# EAGLE board axiom_beta_sensor_cmv12000_zif (EAGLE 7.7.0), part 1 of 2
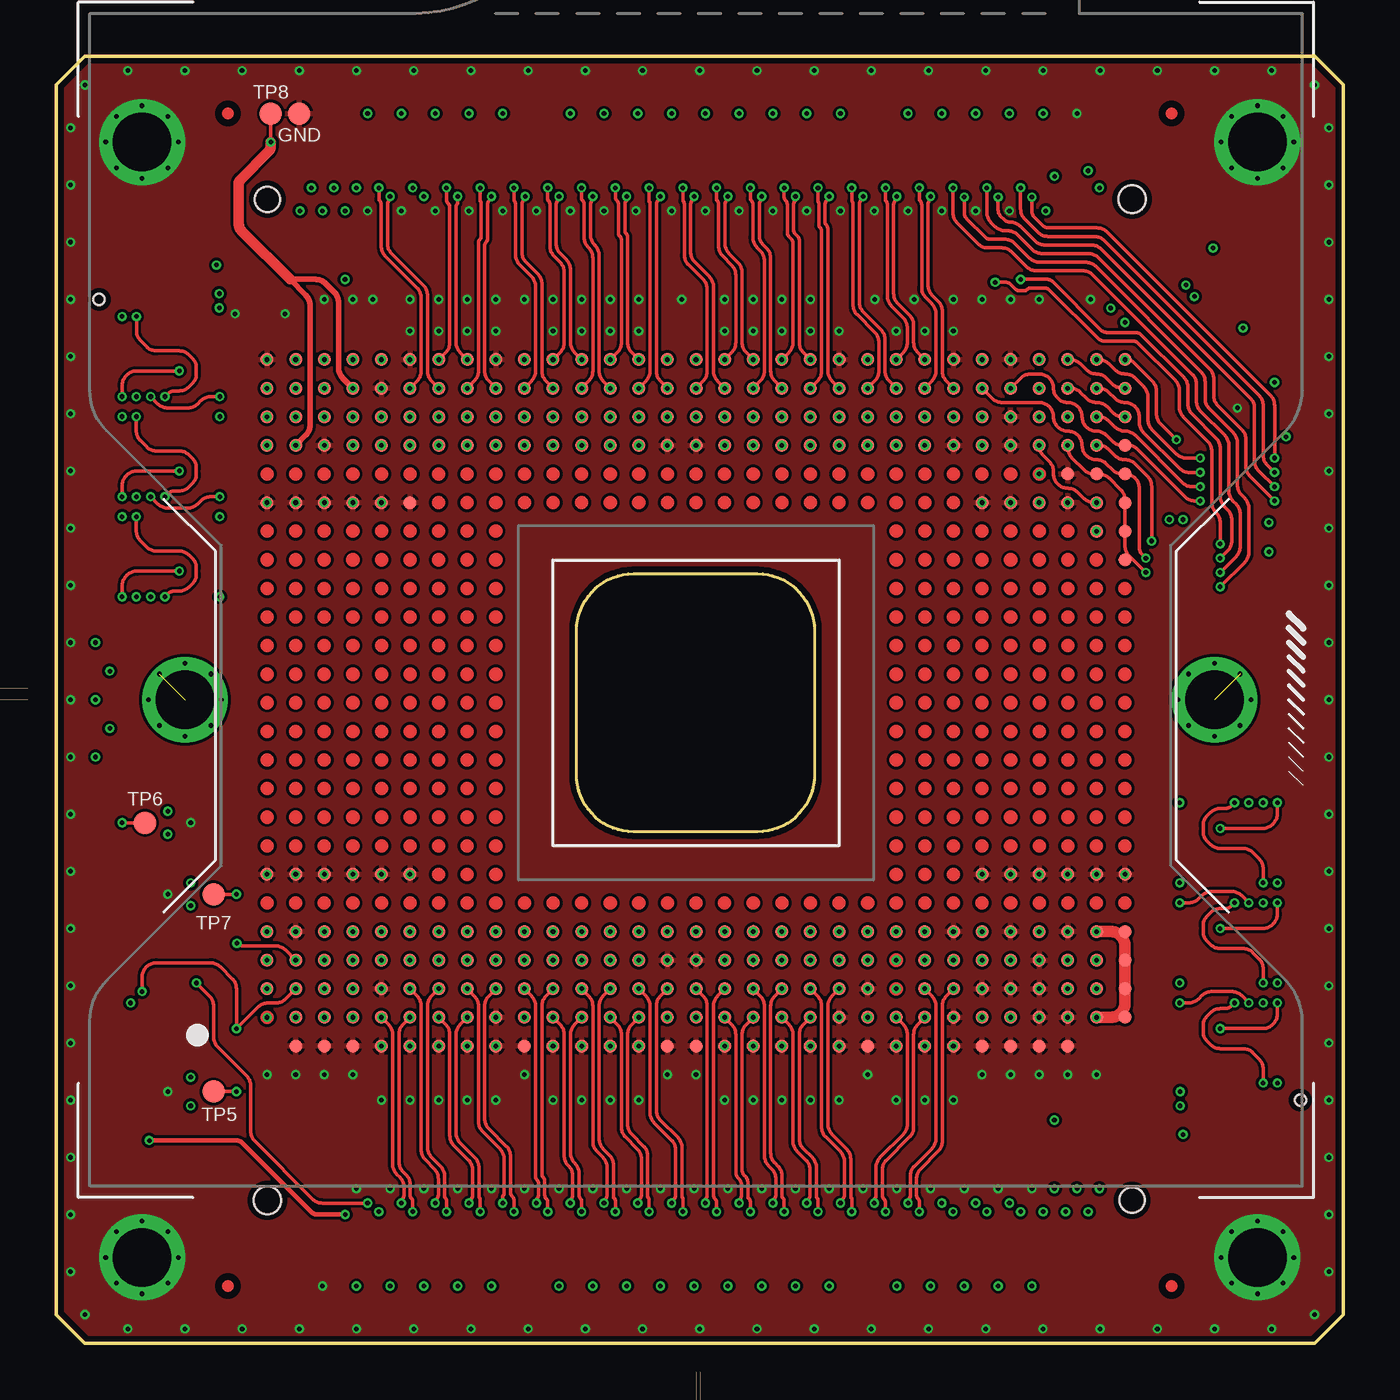
[diagram p5: board, top side]
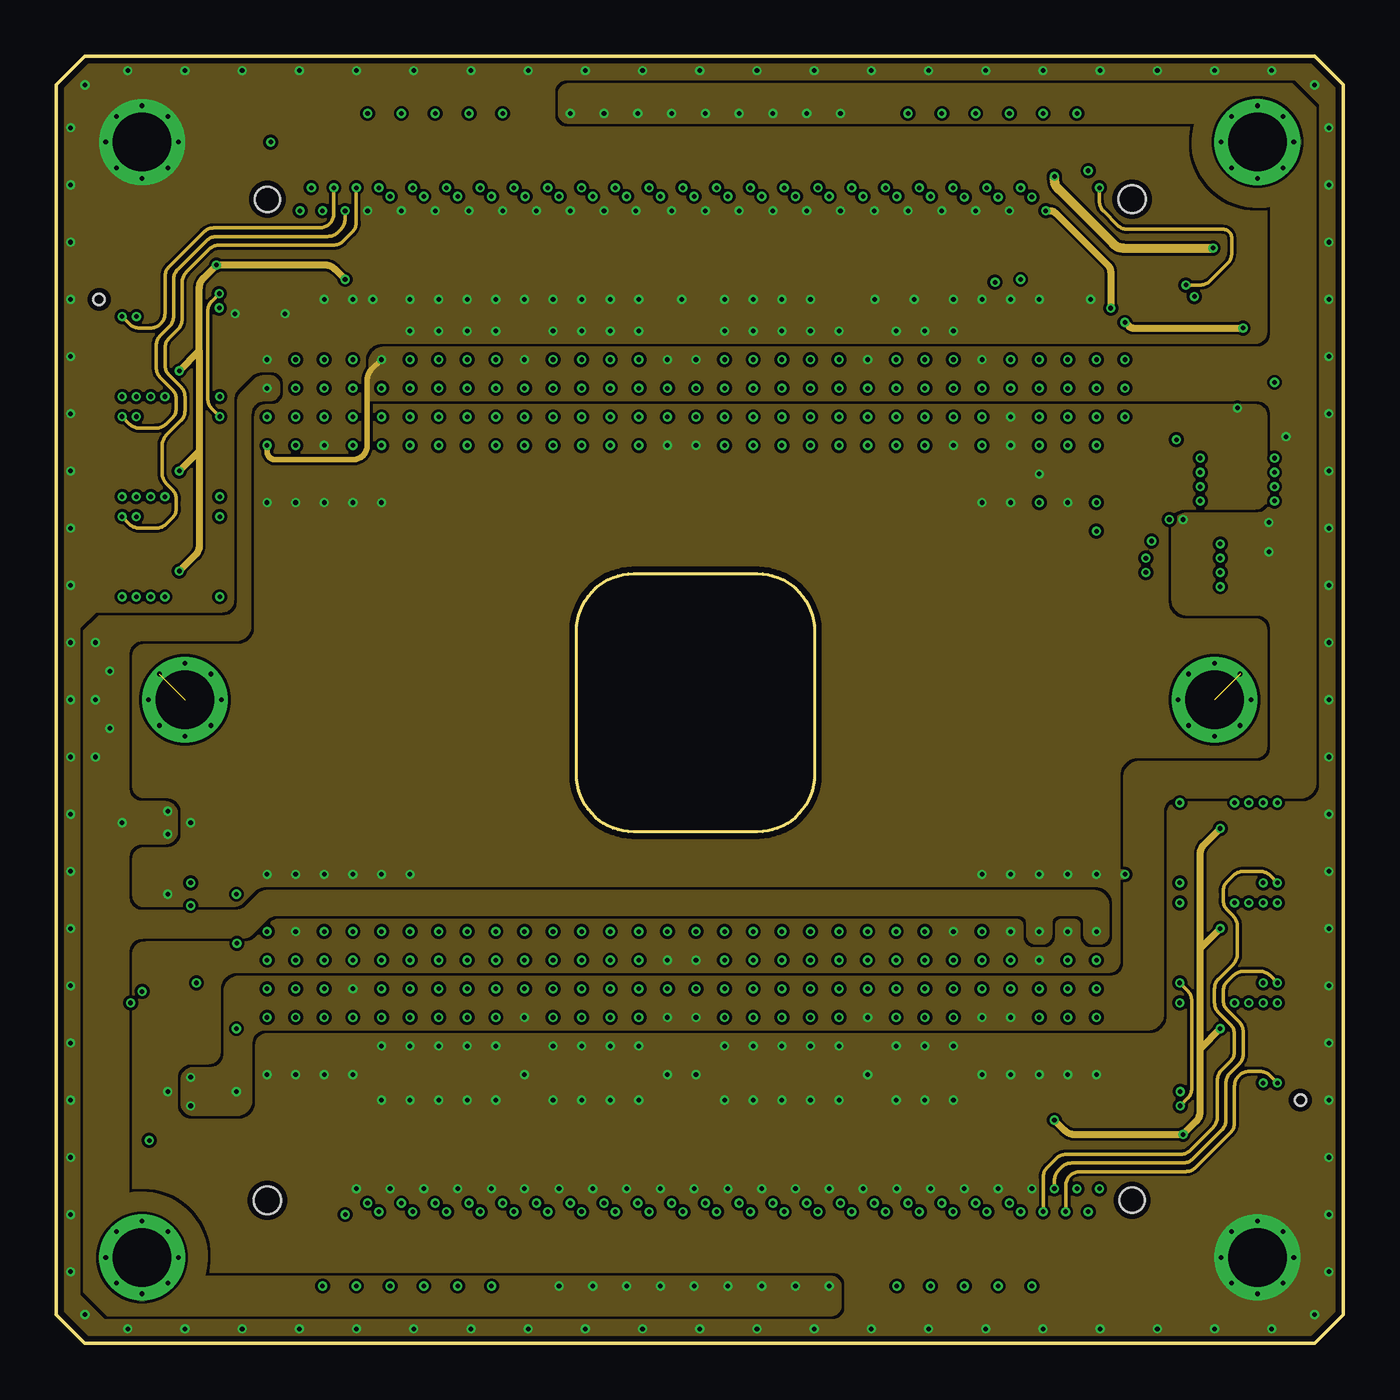
[diagram p6: board, inner layer Route2]
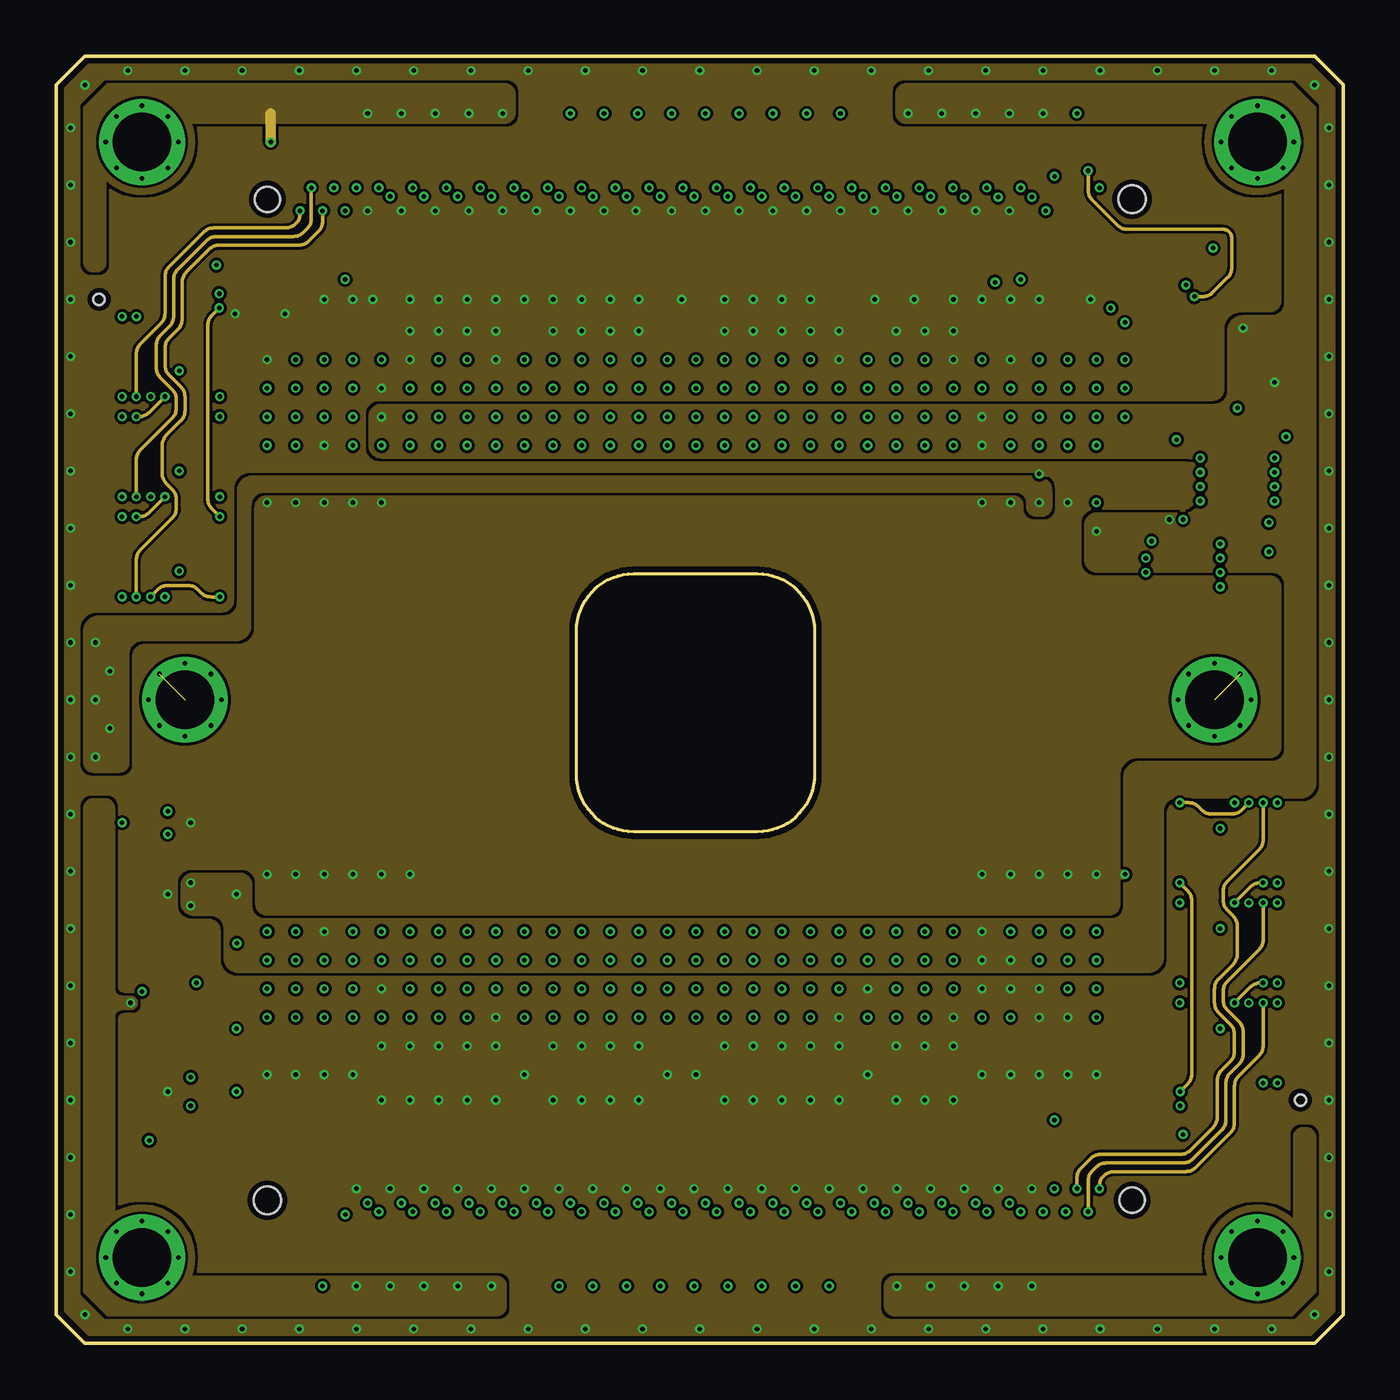
[diagram p7: board, inner layer Route15]
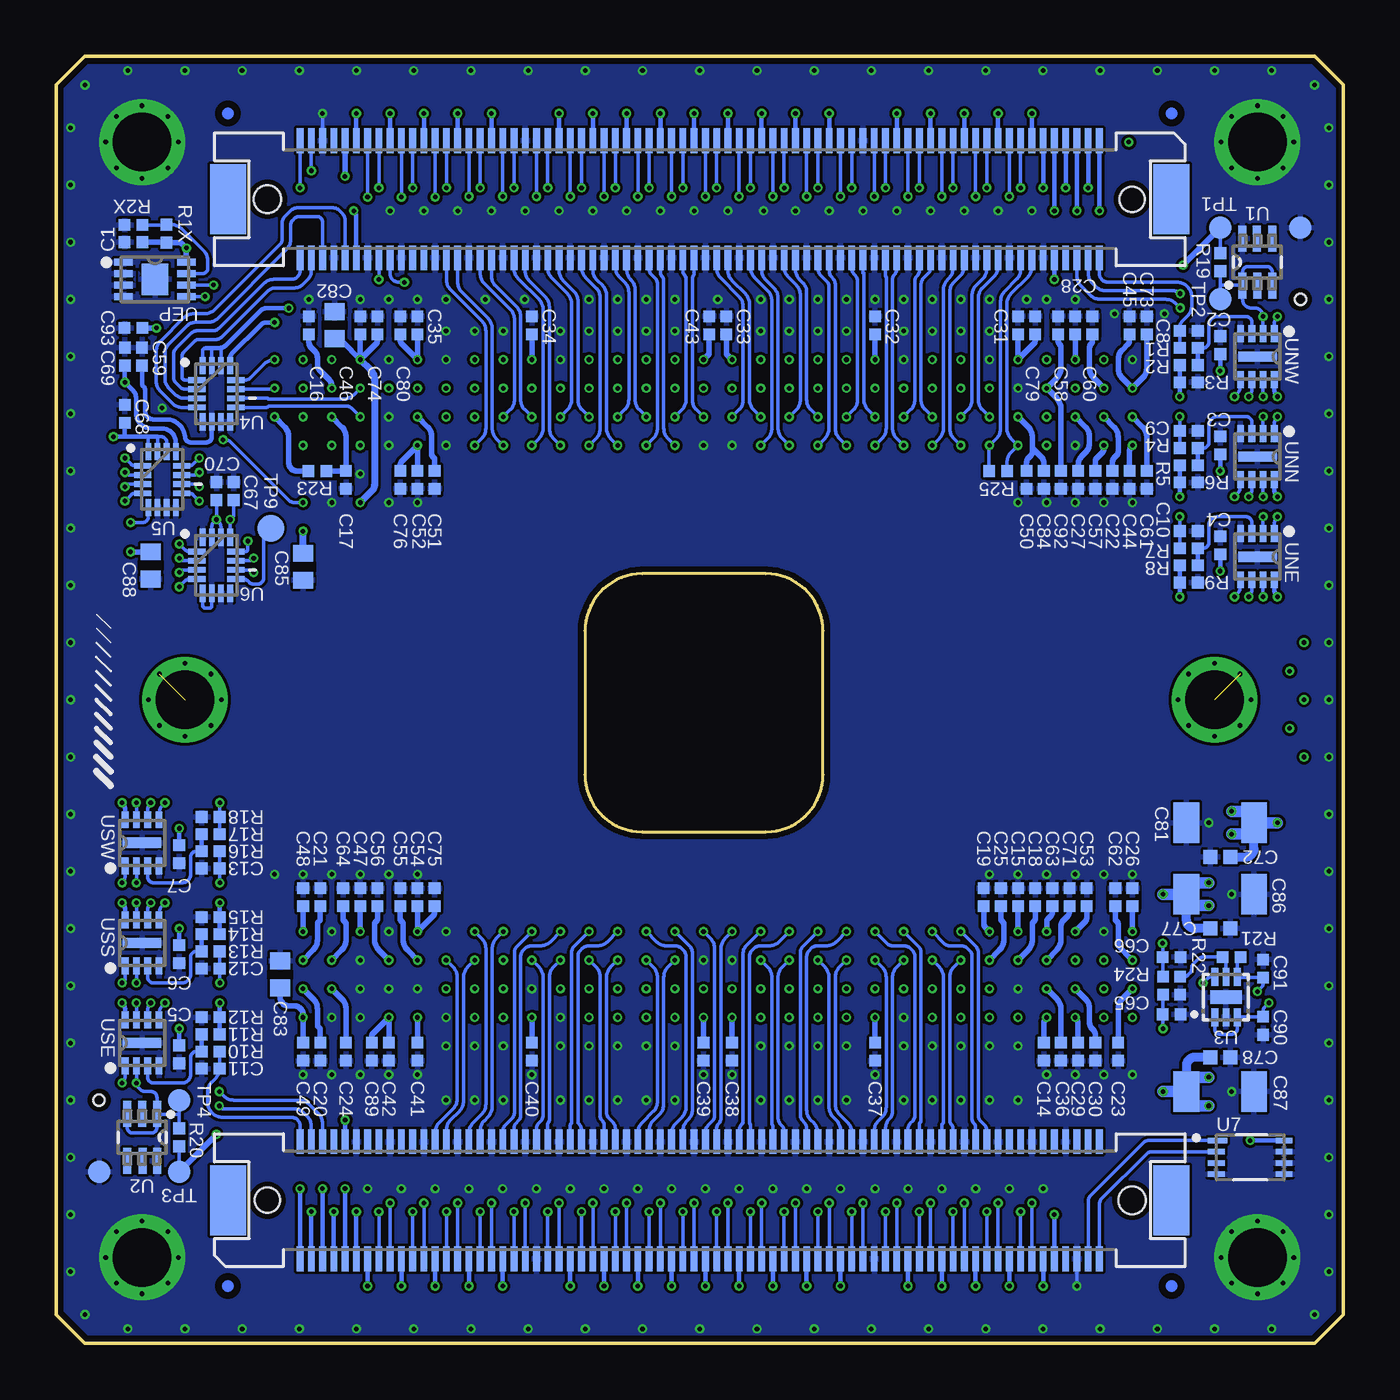
[diagram p8: board, bottom side, seen from below]

Size 57.15 x 57.15 mm. Coordinates in mm from the lower left corner, seen from the top.
Outline: 55.88,57.15 1.27,57.15 0,55.88 0,1.27 1.27,0 55.88,0 57.15,1.27 57.15,55.88 55.88,57.15
Outline: 31.13,22.71 25.64,22.71 arc-90 23.1,25.25 23.1,31.63 arc-90 25.64,34.17 31.13,34.17 arc-90 33.67,31.63 33.67,25.25 arc-90 31.13,22.71
Copper layers (1*2*15*16): Top 0.035559375mm / dielectric 0.17018125mm / Route2 0.01778125mm / dielectric 47mil / Route15 0.01778125mm / dielectric 0.17018125mm / Bottom 0.035559375mm
Design rules "axiom_beta_interface_OSHPark-4layer-tuned *": minimum track width 5mil, minimum drill 8mil, track to track 5mil, track to pad 5mil, pad to pad 5mil, via to via 5mil, smd to smd 5mil, copper to edge 10mil, drill to drill 6mil, minimum pad ring 4mil, minimum via ring 4mil, stop-mask expansion 2mil, vias tented up to drill 15mil, thermal gap 5mil
Net classes: 0 default: width 0.152 mm, drill 0.203 mm; 1 power: width 0.152 mm, drill 0.203 mm
Holes 0.5 mm at 55.25,10.79 1.9,46.36
tKeepout: area 50.8,1.3 to 55.9,6.3; area 50.8,50.8 to 55.9,55.9; area 1.3,1.3 to 6.3,6.3; area 1.3,50.8 to 6.3,55.9
bKeepout: area 1.4,24.8 to 13.4,32.4; area 43.9,24.8 to 56,32.4; area 50.8,1.3 to 55.9,6.3; area 1.3,50.8 to 6.3,55.9; area 50.8,50.8 to 55.9,55.9; area 1.3,1.3 to 6.3,6.3
tRestrict: area 49,54.1 to 50.1,55.2; area 7.1,2 to 8.2,3.1; area 7.1,54.1 to 8.2,55.2; area 49,2 to 50.1,3.1
bRestrict: area 49,54.1 to 50.1,55.2; area 7.1,2 to 8.2,3.1; area 7.1,54.1 to 8.2,55.2; area 49,2 to 50.1,3.1; area 48.9,41.7 to 49.5,41.8; area 48.9,42.1 to 49.5,42.2; area 52,36.9 to 52.1,37.3; area 52.4,36.9 to 52.5,37.3; area 51.6,36.9 to 51.7,37.3; area 49.6,33.1 to 49.7,33.5; area 49.2,33.1 to 49.3,33.5; area 53.9,47.7 to 54.5,47.8; 139 more areas

## Footprints (pad centres in the part's own frame; a part is rotated, then mirrored left to right if it is on the bottom)
0402-C = smd 0.52 x 0.52: 1 -0.4,0; 2 0.4,0
0402-B = smd 0.62 x 0.62: 1 -0.45,0; 2 0.45,0
1206-B = smd 1.15 x 1.8: 1 -1.5,0; 2 1.5,0
0603-C = smd 0.75 x 0.9: 1 -0.6,0; 2 0.6,0
TP10R = smd 1 x 1: TP 0,0
ZIF-604 = smd 0.584 x 0.584: A2 -17.945,-14.105; A3 -16.675,-14.105; A4 -15.405,-14.105; A5 -14.135,-14.105; A6 -12.865,-14.105; A7 -11.595,-14.105; A8 -10.325,-14.105; A9 -9.055,-14.105; A10 -7.785,-14.105; A11 -6.515,-14.105; A12 -5.245,-14.105; A13 -3.975,-14.105; A14 -2.705,-14.105; A15 -1.435,-14.105; A16 -0.165,-14.105; A17 1.105,-14.105; A18 2.375,-14.105; A19 3.645,-14.105; A20 4.915,-14.105; A21 6.185,-14.105; A22 7.455,-14.105; A23 8.725,-14.105; A24 9.995,-14.105; A25 11.265,-14.105; A26 12.535,-14.105; A27 13.805,-14.105; A28 15.075,-14.105; A29 16.345,-14.105; A30 17.615,-14.105; B1 -19.215,-12.835; B2 -17.945,-12.835; B3 -16.675,-12.835; B4 -15.405,-12.835; B5 -14.135,-12.835; B6 -12.865,-12.835; B7 -11.595,-12.835; B8 -10.325,-12.835; B9 -9.055,-12.835; B10 -7.785,-12.835; B11 -6.515,-12.835; B12 -5.245,-12.835; B13 -3.975,-12.835; B14 -2.705,-12.835; B15 -1.435,-12.835; B16 -0.165,-12.835; B17 1.105,-12.835; B18 2.375,-12.835; B19 3.645,-12.835; B20 4.915,-12.835; B21 6.185,-12.835; B22 7.455,-12.835; B24 9.995,-12.835; B25 11.265,-12.835; B26 12.535,-12.835; B27 13.805,-12.835; B28 15.075,-12.835; B29 16.345,-12.835; B30 17.615,-12.835; C1 -19.215,-11.565; C2 -17.945,-11.565; C3 -16.675,-11.565; C4 -15.405,-11.565; C5 -14.135,-11.565; C6 -12.865,-11.565; C7 -11.595,-11.565; C8 -10.325,-11.565; C9 -9.055,-11.565; C10 -7.785,-11.565; C11 -6.515,-11.565; C12 -5.245,-11.565; C13 -3.975,-11.565; C14 -2.705,-11.565; C15 -1.435,-11.565; C16 -0.165,-11.565; C17 1.105,-11.565; C18 2.375,-11.565; C19 3.645,-11.565; C20 4.915,-11.565; C21 6.185,-11.565; C22 7.455,-11.565; C24 9.995,-11.565; C25 11.265,-11.565; C26 12.535,-11.565; C27 13.805,-11.565; C28 15.075,-11.565; C29 16.345,-11.565; C30 17.615,-11.565; D1 -19.215,-10.295; D2 -17.945,-10.295; D3 -16.675,-10.295; D4 -15.405,-10.295; D5 -14.135,-10.295; D6 -12.865,-10.295; D7 -11.595,-10.295; D8 -10.325,-10.295; D9 -9.055,-10.295; D10 -7.785,-10.295; D11 -6.515,-10.295; D12 -5.245,-10.295; D13 -3.975,-10.295; D14 -2.705,-10.295; D15 -1.435,-10.295; D16 -0.165,-10.295; D17 1.105,-10.295; D18 2.375,-10.295; D19 3.645,-10.295; D20 4.915,-10.295; D21 6.185,-10.295; D22 7.455,-10.295; D23 8.725,-10.295; D24 9.995,-10.295; D25 11.265,-10.295; D26 12.535,-10.295; D27 13.805,-10.295; D28 15.075,-10.295; D29 16.345,-10.295; D30 17.615,-10.295; E1 -19.215,11.295; E2 -17.945,11.295; E3 -16.675,11.295; E4 -15.405,11.295; E5 -14.135,11.295; E6 -12.865,11.295; E7 -11.595,11.295; E8 -10.325,11.295; E9 -9.055,11.295; E10 -7.785,11.295; E11 -6.515,11.295; E12 -5.245,11.295; E13 -3.975,11.295; E14 -2.705,11.295; E15 -1.435,11.295; E16 -0.165,11.295; E17 1.105,11.295; E18 2.375,11.295; E19 3.645,11.295; E20 4.915,11.295; E21 6.185,11.295; E22 7.455,11.295; E23 8.725,11.295; E24 9.995,11.295; E25 11.265,11.295; E26 12.535,11.295; E27 13.805,11.295; E28 15.075,11.295; E29 16.345,11.295; E30 17.615,11.295; F1 -19.215,12.565; F2 -17.945,12.565; F3 -16.675,12.565; F4 -15.405,12.565; F5 -14.135,12.565; F6 -12.865,12.565; F7 -11.595,12.565; F8 -10.325,12.565; F9 -9.055,12.565; F10 -7.785,12.565; F11 -6.515,12.565; F12 -5.245,12.565; F13 -3.975,12.565; F14 -2.705,12.565; F15 -1.435,12.565; F16 -0.165,12.565; F17 1.105,12.565; F18 2.375,12.565; F19 3.645,12.565; F20 4.915,12.565; F21 6.185,12.565; F22 7.455,12.565; F23 8.725,12.565; F24 9.995,12.565; F25 11.265,12.565; F26 12.535,12.565; F27 13.805,12.565; F28 15.075,12.565; F29 16.345,12.565; F30 17.615,12.565; G1 -19.215,13.835; G2 -17.945,13.835; G3 -16.675,13.835; G4 -15.405,13.835; G5 -14.135,13.835; G6 -12.865,13.835; G7 -11.595,13.835; G8 -10.325,13.835; G9 -9.055,13.835; G10 -7.785,13.835; G11 -6.515,13.835; G12 -5.245,13.835; G13 -3.975,13.835; G14 -2.705,13.835; G15 -1.435,13.835; G16 -0.165,13.835; G17 1.105,13.835; G18 2.375,13.835; G19 3.645,13.835; G20 4.915,13.835; G21 6.185,13.835; G22 7.455,13.835; G23 8.725,13.835; G24 9.995,13.835; G25 11.265,13.835; G26 12.535,13.835; G27 13.805,13.835; G28 15.075,13.835; G29 16.345,13.835; G30 17.615,13.835; H1 -19.215,15.105; H2 -17.945,15.105; H3 -16.675,15.105; H4 -15.405,15.105; H5 -14.135,15.105; H6 -12.865,15.105; H7 -11.595,15.105; H8 -10.325,15.105; H9 -9.055,15.105; H10 -7.785,15.105; H11 -6.515,15.105; H12 -5.245,15.105; H13 -3.975,15.105; H14 -2.705,15.105; H15 -1.435,15.105; H16 -0.165,15.105; H17 1.105,15.105; H18 2.375,15.105; H19 3.645,15.105; H20 4.915,15.105; H21 6.185,15.105; H22 7.455,15.105; H23 8.725,15.105; H24 9.995,15.105; H25 11.265,15.105; H26 12.535,15.105; H27 13.805,15.105; H28 15.075,15.105; H29 16.345,15.105; H30 17.615,15.105; X2 -17.945,-15.375; X3 -16.675,-15.375; X4 -15.405,-15.375; X5 -14.135,-15.375; X6 -12.865,-15.375; X7 -11.595,-15.375; X8 -10.325,-15.375; X9 -9.055,-15.375; X10 -7.785,-15.375; X11 -6.515,-15.375; X12 -5.245,-15.375; X13 -3.975,-15.375; X14 -2.705,-15.375; X15 -1.435,-15.375; X16 -0.165,-15.375; X17 1.105,-15.375; X18 2.375,-15.375; X19 3.645,-15.375; X20 4.915,-15.375; X21 6.185,-15.375; X22 7.455,-15.375; X23 8.725,-15.375; X24 9.995,-15.375; X25 11.265,-15.375; X26 12.535,-15.375; X27 13.805,-15.375; X28 15.075,-15.375; X29 16.345,-15.375; Y1 -19.215,-7.755; Y2 -17.945,-7.755; Y3 -16.675,-7.755; Y4 -15.405,-7.755; Y5 -14.135,-7.755; Y6 -12.865,-7.755; Y7 12.535,-7.755; Y8 13.805,-7.755; Y9 15.075,-7.755; Y10 16.345,-7.755; Y11 17.615,-7.755; Y12 18.885,-7.755; Y13 -19.215,8.755; Y14 -17.945,8.755; Y15 -16.675,8.755; Y16 -15.405,8.755; Y17 -14.135,8.755; Y18 -12.865,8.755; Y19 12.535,8.755; Y20 13.805,8.755; Y21 15.075,8.755; Y22 16.345,8.755; Y23 17.615,8.755; Y24 18.885,8.755; Z1 18.885,-14.105; Z2 18.885,-12.835; Z3 18.885,-11.565; Z4 18.885,-10.295; Z5 18.885,6.215; Z6 18.885,7.485; Z7 18.885,10.025; Z8 18.885,11.295; Z9 18.885,12.565; Z10 18.885,13.835; Z11 18.885,15.105; Z12 17.615,7.485; Z13 17.615,10.025; Z14 16.345,10.025
TP12R = smd 1.2 x 1.2: TP 0,0
SOT65P210X110-6N = smd 1.168 x 0.356: 1 -1.041,0.66; 2 -1.041,0; 3 -1.041,-0.66; 4 1.041,-0.66; 5 1.041,0.025; 6 1.041,0.66
MLF-6 = smd 0.3 x 0.8: 1 -0.5,-0.9; 2 0,-0.9; 3 0.5,-0.9; 4 0.5,0.9; 5 0,0.9; 6 -0.5,0.9 | smd 1.4 x 0.6: EP 0,0
QFN40P185X265X55-16N = smd 0.762 x 0.254: 1 -0.864,0.61; 2 -0.864,0.203; 3 -0.864,-0.203; 4 -0.864,-0.61; 9 0.864,-0.61; 10 0.864,-0.203; 11 0.864,0.203; 12 0.864,0.61 | smd 0.254 x 0.762: 5 -0.61,-1.245; 6 -0.203,-1.245; 7 0.203,-1.245; 8 0.61,-1.245; 13 0.61,1.245; 14 0.203,1.245; 15 -0.203,1.245; 16 -0.61,1.245
SOT996-2/3 = smd 0.25 x 0.85: 1 -0.75,-1.45 | smd 0.25 x 0.75: 2 -0.25,-1.5; 3 0.25,-1.5; 4 0.75,-1.5; 5 0.75,1.5; 6 0.25,1.5; 7 -0.25,1.5; 8 -0.75,1.5
DFN200X300X100-9N = smd 0.813 x 0.305: 1 -1.397,0.762; 2 -1.397,0.254; 3 -1.397,-0.254; 4 -1.397,-0.762; 5 1.397,-0.762; 6 1.397,-0.254; 7 1.397,0.254; 8 1.397,0.762 | smd 1.194 x 1.397: EP 0,0
DFN200X200X100-9N = smd 0.75 x 0.3: 1 -1.025,0.75; 2 -1.025,0.25; 3 -1.025,-0.25; 4 -1.025,-0.75; 5 1.025,-0.75; 6 1.025,-0.25; 7 1.025,0.25; 8 1.025,0.75 | smd 0.45 x 1.7: EP 0,0
FX10A-144P = smd 0.3 x 1.1: 1 -17.75,-2.6; 2 -17.75,2.6; 3 -17.25,-2.6; 4 -17.25,2.6; 5 -16.75,-2.6; 6 -16.75,2.6; 7 -16.25,-2.6; 8 -16.25,2.6; 9 -15.75,-2.6; 10 -15.75,2.6; 11 -15.25,-2.6; 12 -15.25,2.6; 13 -14.75,-2.6; 14 -14.75,2.6; 15 -14.25,-2.6; 16 -14.25,2.6; 17 -13.75,-2.6; 18 -13.75,2.6; 19 -13.25,-2.6; 20 -13.25,2.6; 21 -12.75,-2.6; 22 -12.75,2.6; 23 -12.25,-2.6; 24 -12.25,2.6; 25 -11.75,-2.6; 26 -11.75,2.6; 27 -11.25,-2.6; 28 -11.25,2.6; 29 -10.75,-2.6; 30 -10.75,2.6; 31 -10.25,-2.6; 32 -10.25,2.6; 33 -9.75,-2.6; 34 -9.75,2.6; 35 -9.25,-2.6; 36 -9.25,2.6; 37 -8.75,-2.6; 38 -8.75,2.6; 39 -8.25,-2.6; 40 -8.25,2.6; 41 -7.75,-2.6; 42 -7.75,2.6; 43 -7.25,-2.6; 44 -7.25,2.6; 45 -6.75,-2.6; 46 -6.75,2.6; 47 -6.25,-2.6; 48 -6.25,2.6; 49 -5.75,-2.6; 50 -5.75,2.6; 51 -5.25,-2.6; 52 -5.25,2.6; 53 -4.75,-2.6; 54 -4.75,2.6; 55 -4.25,-2.6; 56 -4.25,2.6; 57 -3.75,-2.6; 58 -3.75,2.6; 59 -3.25,-2.6; 60 -3.25,2.6; 61 -2.75,-2.6; 62 -2.75,2.6; 63 -2.25,-2.6; 64 -2.25,2.6; 65 -1.75,-2.6; 66 -1.75,2.6; 67 -1.25,-2.6; 68 -1.25,2.6; 69 -0.75,-2.6; 70 -0.75,2.6; 71 -0.25,-2.6; 72 -0.25,2.6; 73 0.25,-2.6; 74 0.25,2.6; 75 0.75,-2.6; 76 0.75,2.6; 77 1.25,-2.6; 78 1.25,2.6; 79 1.75,-2.6; 80 1.75,2.6; 81 2.25,-2.6; 82 2.25,2.6; 83 2.75,-2.6; 84 2.75,2.6; 85 3.25,-2.6; 86 3.25,2.6; 87 3.75,-2.6; 88 3.75,2.6; 89 4.25,-2.6; 90 4.25,2.6; 91 4.75,-2.6; 92 4.75,2.6; 93 5.25,-2.6; 94 5.25,2.6; 95 5.75,-2.6; 96 5.75,2.6; 97 6.25,-2.6; 98 6.25,2.6; 99 6.75,-2.6; 100 6.75,2.6; 101 7.25,-2.6; 102 7.25,2.6; 103 7.75,-2.6; 104 7.75,2.6; 105 8.25,-2.6; 106 8.25,2.6; 107 8.75,-2.6; 108 8.75,2.6; 109 9.25,-2.6; 110 9.25,2.6; 111 9.75,-2.6; 112 9.75,2.6; 113 10.25,-2.6; 114 10.25,2.6; 115 10.75,-2.6; 116 10.75,2.6; 117 11.25,-2.6; 118 11.25,2.6; 119 11.75,-2.6; 120 11.75,2.6; 121 12.25,-2.6; 122 12.25,2.6; 123 12.75,-2.6; 124 12.75,2.6; 125 13.25,-2.6; 126 13.25,2.6; 127 13.75,-2.6; 128 13.75,2.6; 129 14.25,-2.6; 130 14.25,2.6; 131 14.75,-2.6; 132 14.75,2.6; 133 15.25,-2.6; 134 15.25,2.6; 135 15.75,-2.6; 136 15.75,2.6; 137 16.25,-2.6; 138 16.25,2.6; 139 16.75,-2.6; 140 16.75,2.6; 141 17.25,-2.6; 142 17.25,2.6; 143 17.75,-2.6; 144 17.75,2.6 | smd 1.6 x 3.1: M1 -20.95,0; M2 20.95,0 | hole 1.125: -19.2,0 | hole 1.225: 19.2,0

## Placement (x,y rotation side)
C1  100n  [0402-C]  53.72,48.89 180 bottom
C2  100n  [0402-C]  5.46,44.32 90 bottom
C3  100n  [0402-C]  5.46,39.88 90 bottom
C4  100n  [0402-C]  5.46,35.43 90 bottom
C5  100n  [0402-C]  51.69,12.83 270 bottom
C6  100n  [0402-C]  51.69,17.27 270 bottom
C7  100n  [0402-C]  51.69,21.72 270 bottom
C8  1µ  [0402-C]  6.86,44.96 0 bottom
C9  1µ  [0402-C]  6.86,40.51 0 bottom
C10  1µ  [0402-C]  6.86,36.07 0 bottom
C11  1µ  [0402-C]  50.29,12.19 180 bottom
C12  1µ  [0402-C]  50.29,16.64 180 bottom
C13  1µ  [0402-C]  50.29,21.08 180 bottom
C14  100n  [0402-C]  13.3,12.95 270 bottom
C15  100n  [0402-C]  14.44,19.8 90 bottom
C16  100n  [0402-C]  45.94,45.2 90 bottom
C17  100n  [0402-C]  44.28,38.35 270 bottom
C18  100n  [0402-C]  13.68,19.8 90 bottom
C19  100n  [0402-C]  15.96,19.8 90 bottom
C20  100n  [0402-C]  45.43,12.95 270 bottom
C21  100n  [0402-C]  45.43,19.8 90 bottom
C22  100n  [0402-C]  10.25,38.35 90 bottom
C23  100n  [0402-C]  10,12.95 90 bottom
C24  100n  [0402-C]  44.28,12.95 90 bottom
C25  100n  [0402-C]  15.2,19.8 270 bottom
C26  100n  [0402-C]  9.36,19.8 270 bottom
C27  100n  [0402-C]  11.77,38.35 90 bottom
C28  100n  [0402-C]  11.9,45.2 270 bottom
C29  100n  [0402-C]  11.77,12.95 270 bottom
C30  100n  [0402-C]  11.01,12.95 270 bottom
C31  100n  [0402-C]  14.44,45.2 90 bottom
C32  100n  [0402-C]  20.79,45.2 90 bottom
C33  100n  [0402-C]  27.39,45.2 90 bottom
C34  100n  [0402-C]  36.03,45.2 90 bottom
C35  100n  [0402-C]  41.11,45.2 90 bottom
C36  100n  [0402-C]  12.54,12.95 270 bottom
C37  100n  [0402-C]  20.79,12.95 270 bottom
C38  100n  [0402-C]  27.14,12.95 270 bottom
C39  100n  [0402-C]  28.41,12.95 270 bottom
C40  100n  [0402-C]  36.03,12.95 270 bottom
C41  100n  [0402-C]  41.11,12.95 270 bottom
C42  100n  [0402-C]  42.38,12.95 270 bottom
C43  100n  [0402-C]  28.16,45.2 90 bottom
C44  100n  [0402-C]  9.49,38.35 270 bottom
C45  100n  [0402-C]  9.49,45.2 90 bottom
C46  100n  [0402-C]  43.65,45.2 90 bottom
C47  100n  [0402-C]  43.65,19.8 90 bottom
C48  100n  [0402-C]  46.19,19.8 90 bottom
C49  100n  [0402-C]  46.19,12.95 270 bottom
C50  100n  [0402-C]  14.06,38.35 270 bottom
C51  100n  [0402-C]  40.35,38.35 270 bottom
C52  100n  [0402-C]  41.11,38.35 270 bottom
C53  100n  [0402-C]  11.39,19.8 90 bottom
C54  100n  [0402-C]  41.11,19.8 90 bottom
C55  100n  [0402-C]  41.87,19.8 90 bottom
C56  100n  [0402-C]  42.89,19.8 90 bottom
C57  100n  [0402-C]  11.01,38.35 270 bottom
C58  100n  [0402-C]  12.66,45.2 90 bottom
C59  100n  [0402-C]  53.34,43.81 90 bottom
C60  100n  [0402-C]  11.14,45.2 90 bottom
C61  100n  [0402-C]  8.72,38.35 270 bottom
C62  100n  [0402-C]  10.12,19.8 90 bottom
C63  100n  [0402-C]  12.92,19.8 90 bottom
C64  100n  [0402-C]  44.41,19.8 90 bottom
C65  100n  [0402-C]  7.62,14.6 0 bottom
C66  100n  [0402-C]  7.62,17.14 0 bottom
C67  100n  [0402-C]  49.28,37.85 90 bottom
C68  100n  [0402-C]  54.1,41.27 90 bottom
C69  100n  [0402-C]  54.1,43.81 90 bottom
C70  100n  [0402-C]  50.04,37.85 90 bottom
C71  100n  [0402-C]  12.15,19.8 90 bottom
C72  4µ7  [0402-B]  5.46,21.59 180 bottom
C73  4µ7  [0402-C]  8.72,45.2 90 bottom
C74  4µ7  [0402-C]  42.89,45.2 90 bottom
C75  4µ7  [0402-C]  40.35,19.8 90 bottom
C76  4µ7  [0402-C]  41.87,38.35 270 bottom
C77  4µ7  [0402-B]  5.46,18.41 0 bottom
C78  4µ7  [0402-B]  5.46,12.7 0 bottom
C79  4µ7  [0402-C]  13.68,45.2 90 bottom
C80  4µ7  [0402-C]  41.87,45.2 90 bottom
C81  100µ  [1206-B]  5.46,23.11 180 bottom
C82  10µ  [0603-C]  44.79,45.2 90 bottom
C83  10µ  [0603-C]  47.21,16.38 90 bottom
C84  4µ7  [0402-C]  13.3,38.35 270 bottom
C85  10µ  [0603-C]  46.19,34.48 270 bottom
C86  100µ  [1206-B]  5.46,19.94 0 bottom
C87  100µ  [1206-B]  5.46,11.18 0 bottom
C88  10µ  [0603-C]  52.96,34.54 270 bottom
C89  4µ7  [0402-C]  43.14,12.95 270 bottom
C90  4µ7  [0402-C]  3.56,14.1 270 bottom
C91  4µ7  [0402-C]  3.56,16.64 270 bottom
C92  4µ7  [0402-C]  12.54,38.35 270 bottom
C93  100n  [0402-C]  53.72,45.09 180 bottom
GND  TPTP10R  [TP10R]  10.79,54.61 0 top
GND75  TPTP10R  [TP10R]  1.9,49.53 180 bottom
GND77  TPTP10R  [TP10R]  55.25,7.62 180 bottom
PARALLELLA  [PARALLELLA-FRAME]  28.57,28.57 0 top
R1  28k7  [0402-C]  6.86,44.2 0 bottom
R1X  10k  [0402-C]  52.26,49.28 90 bottom
R2  3k32  [0402-C]  6.86,43.43 180 bottom
R2X  [0402-C]  53.72,49.66 180 bottom
R3  16k9  [0402-C]  6.86,42.67 0 bottom
R4  15k4  [0402-C]  6.86,39.75 0 bottom
R5  3k09  [0402-C]  6.86,38.99 180 bottom
R6  30k9  [0402-C]  6.86,38.23 0 bottom
R7  28k7  [0402-C]  6.86,35.31 0 bottom
R8  3k32  [0402-C]  6.86,34.54 180 bottom
R9  16k9  [0402-C]  6.86,33.78 0 bottom
R10  [0402-C]  50.29,12.95 180 bottom
R11  [0402-C]  50.29,13.72 0 bottom
R12  [0402-C]  50.29,14.48 180 bottom
R13  22k6  [0402-C]  50.29,17.4 180 bottom
R14  9k53  [0402-C]  50.29,18.16 0 bottom
R15  16k9  [0402-C]  50.29,18.92 180 bottom
R16  18k7  [0402-C]  50.29,21.84 180 bottom
R17  13k3  [0402-C]  50.29,22.61 0 bottom
R18  16k9  [0402-C]  50.29,23.37 180 bottom
R19  18k  [0402-C]  5.46,48.01 270 bottom
R20  18k  [0402-C]  51.69,9.14 90 bottom
R21  5k9  [0402-C]  4.95,17.14 0 bottom
R22  14k3  [0402-C]  7.24,15.88 90 bottom
R23  0R  [0402-C]  45.55,38.73 0 bottom
R24  0R  [0402-C]  8,15.88 90 bottom
R25  100R  [0402-C]  15.33,38.73 180 bottom
SENSOR  CMV12000-ZIF  [ZIF-604]  28.57,28.57 0 top
TP1  TPTP10R  [TP10R]  5.46,49.53 0 bottom
TP2  TPTP10R  [TP10R]  5.46,46.36 0 bottom
TP3  TPTP10R  [TP10R]  51.69,7.62 0 bottom
TP4  TPTP10R  [TP10R]  51.69,10.79 0 bottom
TP5  TPTP10R  [TP10R]  6.98,11.18 0 top
TP6  TPTP10R  [TP10R]  3.94,23.11 0 top
TP7  TPTP10R  [TP10R]  6.98,19.94 0 top
TP8  TPTP10R  [TP10R]  9.52,54.61 0 top
TP9  TPTP12R  [TP12R]  47.62,36.2 0 bottom
U1  TLV431DCK  [SOT65P210X110-6N]  3.81,48.01 90 bottom
U2  TLV431DCK  [SOT65P210X110-6N]  53.34,9.14 270 bottom
U3  MIC47050YML  [MLF-6]  5.21,15.37 0 bottom
U4  SN74AVC4T774RSV  [QFN40P185X265X55-16N]  50.04,42.16 0 bottom
U5  SN74AVC4T774RSV  [QFN40P185X265X55-16N]  52.45,38.35 0 bottom
U6  SN74AVC4T774RSV  [QFN40P185X265X55-16N]  50.04,34.54 0 bottom
U7  LM75BGD  [SOT996-2/3]  4.13,8.25 270 bottom
U$1  [µZ-FRAME]  28.57,28.57 0 top
UEP  BR24G04NUX  [DFN200X300X100-9N]  52.77,47.24 0 bottom
UNE  TS332IQ2T  [DFN200X200X100-9N]  3.81,34.92 270 bottom
UNN  TS332IQ2T  [DFN200X200X100-9N]  3.81,39.37 270 bottom
UNW  TS332IQ2T  [DFN200X200X100-9N]  3.81,43.81 270 bottom
USE  TS332IQ2T  [DFN200X200X100-9N]  53.34,13.33 90 bottom
USS  TS332IQ2T  [DFN200X200X100-9N]  53.34,17.78 90 bottom
USW  TS332IQ2T  [DFN200X200X100-9N]  53.34,22.23 90 bottom
X-NORTH  FX10-144P  [FX10A-144P]  28.57,50.8 180 bottom
X-SOUTH  FX10-144P  [FX10A-144P]  28.57,6.35 0 bottom

## Tracks (layer width: path | path; a pad name or v marks a point on that pad's centre or on a via)
CLK_IN  (via drill 0.2)
  Top 0.152: v48.64,35.62 48.64,38.05 arc45 48.45,38.5 47.91,39.05 arc45 47.46,39.23 arc-45 47.01,39.42 46.75,39.68 arc45 46.3,39.87 SENSOR.E30
  Bottom 0.152: U6.12 48.77,35.15 arc-90 48.64,35.28 v48.64,35.62
  other vias: 46.19,39.87
FRAME_REQ  (via drill 0.2)
  Top 0.152: 46.22,42.41 SENSOR.G30 46.3,42.41 arc-45 46.75,42.22 47.01,41.96 arc45 47.46,41.77 arc-90 48.09,41.14 48.09,40.89 arc45 48.28,40.45 49.87,38.86 arc45 50.32,38.67 v50.8,38.67
  Bottom 0.152: v50.8,38.67 50.84,38.63 arc45 51.02,38.56 U5.11
  other vias: 46.19,42.41
GND  (via drill 0.2, 2.6 pad 3.81)
  Bottom 0.152: X-NORTH.139 v45.33,54.61 | X-SOUTH.139 v11.82,2.54
  other vias: 1.27,55.88 1.27,1.27 0.63,3.18 0.63,5.71 0.63,8.25 0.63,10.79 0.63,13.33 0.63,15.88 0.63,18.41 0.63,20.95 0.63,23.49 0.63,26.04 0.63,28.57 0.63,31.11 0.63,33.66 0.63,36.2 0.63,38.73 0.63,41.27 0.63,43.81 0.63,46.36 0.63,48.89 0.63,51.44 0.63,53.97 56.52,3.18 56.52,5.71 56.52,8.25 56.52,10.79 56.52,13.33 56.52,15.88 56.52,18.41 56.52,20.95 56.52,23.49 56.52,26.04 56.52,28.57 56.52,31.11 56.52,33.66 56.52,36.2 56.52,38.73 56.52,41.27 56.52,43.81 56.52,46.36 56.52,48.89 56.52,51.44 56.52,53.97 55.88,55.88 53.97,56.52 51.44,56.52 48.89,56.52 46.36,56.52 43.81,56.52 41.27,56.52 38.73,56.52 36.2,56.52 33.66,56.52 31.11,56.52 28.57,56.52 26.04,56.52 23.49,56.52 20.95,56.52 18.41,56.52 15.88,56.52 13.33,56.52 10.79,56.52 8.25,56.52 5.71,56.52 3.18,56.52 53.97,0.63 51.44,0.63 48.89,0.63 46.36,0.63 43.81,0.63 41.27,0.63 38.73,0.63 36.2,0.63 33.66,0.63 31.11,0.63 28.57,0.63 26.04,0.63 23.49,0.63 20.95,0.63 18.41,0.63 15.88,0.63 13.33,0.63 10.79,0.63 8.25,0.63 5.71,0.63 3.18,0.63 55.88,1.27 15.71,46.36 16.98,46.36 18.25,46.36 19.52,46.36 14.06,46.36 20.79,46.36 22.06,46.36 23.33,46.36 24.6,46.36 25.87,46.36 27.77,46.36 29.68,46.36 30.95,46.36 32.22,46.36 33.49,46.36 33.49,44.95 34.76,44.95 32.22,44.95 30.95,44.95 29.68,44.95 25.87,44.95 24.6,44.95 23.33,44.95 22.06,44.95 19.52,44.95 18.25,44.95 16.98,44.95 15.71,44.95 38.57,44.95 39.84,44.95 37.3,44.95 14.44,13.2 15.71,13.2 16.98,13.2 18.25,13.2 19.52,13.2 20.79,11.93 22.06,13.2 23.33,13.2 24.6,13.2 25.87,13.2 27.14,11.93 28.41,11.93 29.68,13.2 30.95,13.2 32.22,13.2 33.49,13.2 34.76,13.2 36.03,11.93 37.3,13.2 38.57,13.2 39.84,13.2 37.3,10.79 38.57,10.79 39.84,10.79 34.76,10.79 33.49,10.79 32.22,10.79 30.95,10.79 29.68,10.79 25.87,10.79 24.6,10.79 23.33,10.79 22.06,10.79 19.52,10.79 18.25,10.79 16.98,10.79 15.71,10.79 14.44,10.79 42.38,46.36 43.65,46.36 11.9,46.36 13.17,46.36 13.17,37.33 14.44,37.33 10.63,37.33 9.36,37.33 42.38,37.33 41.11,20.82 42.38,20.82 43.65,20.82 44.92,20.82 46.19,20.82 9.36,20.82 10.63,20.82 11.9,20.82 13.17,20.82 14.44,20.82 15.71,20.82 41.11,11.93 42.38,11.93 43.65,11.93 44.92,11.93 46.19,11.93 9.36,11.93 10.63,11.93 11.9,11.93 13.17,11.93 16.32,6.86 17.82,6.86 19.32,6.86 20.79,6.86 22.32,6.86 23.82,6.86 25.32,6.86 26.82,6.86 28.32,6.86 29.82,6.86 31.32,6.86 32.83,6.86 34.33,6.86 35.83,6.86 37.33,6.86 38.83,6.86 14.82,6.86 13.82,50.29 15.32,50.29 16.82,50.29 18.32,50.29 19.82,50.29 21.32,50.29 22.82,50.29 24.32,50.29 25.74,50.29 27.32,50.29 28.82,50.29 30.32,50.29 31.82,50.29 33.33,50.29 34.83,50.29 36.33,50.29 37.83,50.29 39.33,50.29 11.9,37.33 41.11,37.33 44.92,37.33 41.11,46.36 10.16,45.72 7.94,45.72 39.84,46.36 34.76,14.47 36.03,15.74 41.11,15.74 42.38,15.74 43.65,15.74 43.65,14.47 43.65,17.01 44.92,18.28 42.38,18.28 39.84,18.28 39.84,14.47 47.46,20.82 14.44,15.74 19.52,14.47 27.14,17.01 28.41,17.01 34.76,43.68 39.84,43.68 42.38,43.68 42.38,41.14 42.38,39.87 39.84,39.87 27.14,39.87 28.41,39.87 15.71,43.68 19.52,43.68 9.36,43.68 11.9,39.87 36.35,46.36 38.1,46.36 14.44,42.41 10.63,18.28 44.92,14.47 40.33,6.86 41.83,6.86 43.33,6.86 13.32,6.86 40.83,50.29 42.33,50.29 43.65,38.6 5.97,23.11 4.95,19.94 4.95,11.18 45.94,46.36 3.81,3.81 53.34,53.34 3.81,5.43 5.43,3.81 3.81,2.19 2.19,3.81 4.95,4.95 4.95,2.67 2.67,2.67 2.67,4.95 53.34,3.81 53.34,5.43 54.96,3.81 53.34,2.19 51.72,3.81 54.48,4.95 54.48,2.67 52.2,2.67 52.2,4.95 53.34,54.96 54.96,53.34 53.34,51.72 51.72,53.34 54.48,54.48 54.48,52.2 52.2,52.2 52.2,54.48 3.81,53.34 3.81,54.96 5.43,53.34 3.81,51.72 2.19,53.34 4.95,54.48 4.95,52.2 2.67,52.2 2.67,54.48 52.45,41.53
  pour Bottom (rank 3): 55.88,57.15 1.27,57.15 0,55.88 0,1.27 1.27,0 55.88,0 57.15,1.27 57.15,55.88
  pour Top: 55.88,57.15 1.27,57.15 0,55.88 0,1.27 1.27,0 55.88,0 57.15,1.27 57.15,55.88
  pour Route2 (rank 3): 55.88,57.15 1.27,57.15 0,55.88 0,1.27 1.27,0 55.88,0 57.15,1.27 57.15,55.88
  pour Route15 (rank 3): 55.88,57.15 1.27,57.15 0,55.88 0,1.27 1.27,0 55.88,0 57.15,1.27 57.15,55.88
N00_N  (via drill 0.2)
  Bottom 0.152: X-NORTH.16 14.32,47.69 arc45 14.51,47.24 15.03,46.73 arc-45 15.21,46.28 15.21,40.63 arc45 15.4,40.18 SENSOR.E6 15.73,39.85 R25.2
  other vias: 15.71,39.87
N00_P  (via drill 0.2)
  Bottom 0.152: X-NORTH.14 13.82,47.8 arc45 14.01,47.35 14.75,46.61 arc-45 14.93,46.16 14.93,40.63 arc-45 14.75,40.18 SENSOR.E5 14.74,39.57 arc-45 14.93,39.12 R25.1
  other vias: 14.44,39.87
N01_N  (via drill 0.2)
  Top 0.152: v14.82,50.93 14.82,50.85 arc-45 14.78,50.75 arc45 14.71,50.57 14.71,48.84 arc45 14.89,48.39 16.3,46.98 arc-45 16.48,46.53 16.48,43.17 arc45 16.67,42.72 SENSOR.G7
  Bottom 0.152: X-NORTH.17 v14.82,50.93
  other vias: 16.98,42.41
N01_P  (via drill 0.2)
  Top 0.152: v14.32,51.31 14.32,50.81 arc45 14.35,50.75 arc-45 14.43,50.57 14.43,48.72 arc45 14.61,48.27 16.02,46.86 arc-45 16.2,46.41 16.2,43.17 arc-45 16.02,42.72 SENSOR.G6
  Bottom 0.152: X-NORTH.15 v14.32,51.31
  other vias: 15.71,42.41
N02_N  (via drill 0.2)
  Bottom 0.152: X-NORTH.22 15.82,47.72 arc45 16.01,47.27 16.3,46.98 arc-45 16.48,46.53 16.48,41.9 arc45 16.67,41.45 SENSOR.F7
  other vias: 16.98,41.14
N02_P  (via drill 0.2)
  Bottom 0.152: X-NORTH.20 15.32,47.82 arc45 15.51,47.37 16.02,46.86 arc-45 16.2,46.41 16.2,41.9 arc-45 16.02,41.45 SENSOR.F6
  other vias: 15.71,41.14
N03_N  (via drill 0.2)
  Bottom 0.152: X-NORTH.23 v16.32,50.93
N03_P  (via drill 0.2)
  Bottom 0.152: X-NORTH.21 v15.82,51.31
N04_N  (via drill 0.2)
  Bottom 0.152: X-NORTH.28 17.32,47.74 arc45 17.51,47.29 17.57,47.23 arc-45 17.75,46.78 17.75,40.63 arc45 17.94,40.18 SENSOR.E8
  other vias: 18.25,39.87
N04_P  (via drill 0.2)
  Bottom 0.152: X-NORTH.26 16.82,47.84 arc45 17.01,47.4 17.29,47.12 arc-45 17.48,46.67 17.48,40.63 arc-45 17.29,40.18 SENSOR.E7
  other vias: 16.98,39.87
N05_N  (via drill 0.2)
  Top 0.152: v17.82,50.93 17.82,50.62 arc45 17.75,50.45 17.75,44.44 arc45 17.94,43.99 SENSOR.H8
  Bottom 0.152: X-NORTH.29 v17.82,50.93
  other vias: 18.25,43.68
N05_P  (via drill 0.2)
  Top 0.152: v17.32,51.31 17.32,50.8 arc45 17.4,50.62 17.4,50.62 arc-45 17.48,50.44 17.48,44.44 arc-45 17.29,43.99 SENSOR.H7
  Bottom 0.152: X-NORTH.27 v17.32,51.31
  other vias: 16.98,43.68
N06_N  (via drill 0.2)
  Bottom 0.152: X-NORTH.34 18.82,47.63 arc45 18.91,47.41 arc-45 19.02,47.14 19.02,41.9 arc45 19.21,41.45 SENSOR.F9
  other vias: 19.52,41.14
N06_P  (via drill 0.2)
  Bottom 0.152: X-NORTH.32 18.32,47.76 arc45 18.44,47.5 18.63,47.3 arc-45 18.74,47.03 18.74,41.9 arc-45 18.56,41.45 SENSOR.F8
  other vias: 18.25,41.14
N07_N  (via drill 0.2)
  Top 0.152: v19.32,50.93 arc-45 19.27,50.79 19.23,50.75 arc45 19.15,50.57 19.15,49.04 arc-45 19.1,48.91 arc45 19.02,48.73 19.02,43.17 arc45 19.21,42.72 SENSOR.G9
  Bottom 0.152: X-NORTH.35 v19.32,50.93
  other vias: 19.52,42.41
N07_P  (via drill 0.2)
  Top 0.152: v18.82,51.31 18.82,50.72 arc-45 18.87,50.61 18.87,49.15 arc-45 18.82,49.03 arc45 18.74,48.85 18.74,43.17 arc-45 18.56,42.72 SENSOR.G8
  Bottom 0.152: X-NORTH.33 v18.82,51.31
  other vias: 18.25,42.41
N08_N  (via drill 0.2)
  Bottom 0.152: X-NORTH.40 20.32,47.4 arc45 20.3,47.33 20.3,40.63 arc45 20.48,40.18 SENSOR.E10
  other vias: 20.79,39.87
N08_P  (via drill 0.2)
  Bottom 0.152: X-NORTH.38 19.82,47.72 arc45 19.94,47.45 arc-45 20.02,47.26 20.02,40.63 arc-45 19.83,40.18 SENSOR.E9
  other vias: 19.52,39.87
N09_N  (via drill 0.2)
  Top 0.152: v20.82,50.93 arc-45 20.75,50.75 20.75,50.75 arc45 20.68,50.57 20.68,48.45 arc45 20.86,48 21.38,47.49 arc-45 21.56,47.04 21.56,43.17 arc45 21.75,42.72 SENSOR.G11
  Bottom 0.152: X-NORTH.41 v20.82,50.93
  other vias: 22.06,42.41
N09_P  (via drill 0.2)
  Top 0.152: v20.32,51.31 20.32,50.74 arc-45 20.4,50.57 20.4,48.34 arc45 20.58,47.89 21.1,47.37 arc-45 21.29,46.92 21.29,43.17 arc-45 21.1,42.72 SENSOR.G10
  Bottom 0.152: X-NORTH.39 v20.32,51.31
  other vias: 20.79,42.41
N10_N  (via drill 0.2)
  Bottom 0.152: X-NORTH.46 21.82,47.73 arc-45 21.71,47.46 21.68,47.42 arc45 21.56,47.16 21.56,41.9 arc45 21.75,41.45 SENSOR.F11
  other vias: 22.06,41.14
N10_P  (via drill 0.2)
  Bottom 0.152: X-NORTH.44 21.32,47.53 arc-135 21.29,47.51 21.29,41.9 arc-45 21.1,41.45 SENSOR.F10
  other vias: 20.79,41.14
N11_N  (via drill 0.2)
  Top 0.152: v22.32,50.93 22.32,50.87 arc-45 22.27,50.75 arc45 22.2,50.57 22.2,48.84 arc45 22.39,48.39 22.65,48.12 arc-45 22.84,47.67 22.84,44.44 arc45 23.02,43.99 SENSOR.H12
  Bottom 0.152: X-NORTH.47 v22.32,50.93
  other vias: 23.33,43.68
N11_P  (via drill 0.2)
  Top 0.152: v21.82,51.31 21.82,50.8 arc45 21.85,50.75 arc-45 21.92,50.57 21.92,48.72 arc45 22.11,48.27 22.37,48.01 arc-45 22.55,47.56 22.55,44.44 arc-45 22.37,43.99 SENSOR.H11
  Bottom 0.152: X-NORTH.45 v21.82,51.31
  other vias: 22.06,43.68
N12_N  (via drill 0.2)
  Bottom 0.152: X-NORTH.52 23.32,47.71 arc-45 23.21,47.44 22.95,47.17 arc45 22.84,46.9 22.84,40.63 arc45 23.02,40.18 SENSOR.E12
  other vias: 23.33,39.87
N12_P  (via drill 0.2)
  Bottom 0.152: X-NORTH.50 22.82,47.6 arc-45 22.71,47.33 22.67,47.29 arc45 22.55,47.02 22.55,40.63 arc-45 22.37,40.18 SENSOR.E11
  other vias: 22.06,39.87
N13_N  (via drill 0.2)
  Top 0.152: v23.82,50.93 23.82,50.81 arc-45 23.8,50.75 arc45 23.72,50.57 23.72,49.22 arc45 23.91,48.77 23.92,48.76 arc-45 24.11,48.31 24.11,43.17 arc45 24.29,42.72 SENSOR.G13
  Bottom 0.152: X-NORTH.53 v23.82,50.93
  other vias: 24.6,42.41
N13_P  (via drill 0.2)
  Top 0.152: v23.32,51.31 23.32,50.86 arc45 23.37,50.75 arc-45 23.44,50.57 23.44,49.1 arc45 23.63,48.65 23.64,48.64 arc-45 23.82,48.19 23.82,43.17 arc-45 23.64,42.72 SENSOR.G12
  Bottom 0.152: X-NORTH.51 v23.32,51.31
  other vias: 23.33,42.41
N14_N  (via drill 0.2)
  Bottom 0.152: X-NORTH.58 24.82,47.79 arc-45 24.64,47.34 24.29,46.99 arc45 24.11,46.54 24.11,41.9 arc45 24.29,41.45 SENSOR.F13
  other vias: 24.6,41.14
N14_P  (via drill 0.2)
  Bottom 0.152: X-NORTH.56 24.32,47.68 arc-45 24.14,47.23 24.01,47.11 arc45 23.82,46.66 23.82,41.9 arc-45 23.64,41.45 SENSOR.F12
  other vias: 23.33,41.14
N15_N  (via drill 0.2)
  Top 0.152: v25.32,50.93 25.32,50.75 arc-45 25.32,50.75 arc45 25.25,50.57 25.25,49.41 arc45 25.3,49.28 arc-45 25.38,49.1 25.38,44.44 arc45 25.56,43.99 SENSOR.H14
  Bottom 0.152: X-NORTH.59 v25.32,50.93
  other vias: 25.87,43.68
N15_P  (via drill 0.2)
  Top 0.152: v24.82,51.31 24.82,50.91 arc45 24.89,50.75 arc-45 24.97,50.57 24.97,49.29 arc45 25.02,49.17 arc-45 25.09,48.99 25.09,44.44 arc-45 24.91,43.99 SENSOR.H13
  Bottom 0.152: X-NORTH.57 v24.82,51.31
  other vias: 24.6,43.68
N16_N  (via drill 0.2)
  Bottom 0.152: X-NORTH.64 26.32,47.76 arc-45 26.14,47.31 25.56,46.74 arc45 25.38,46.29 25.38,40.63 arc45 25.56,40.18 SENSOR.E14
  other vias: 25.87,39.87
N16_P  (via drill 0.2)
  Bottom 0.152: X-NORTH.62 25.82,47.66 arc-45 25.64,47.21 25.28,46.85 arc45 25.09,46.4 25.09,40.63 arc-45 24.91,40.18 SENSOR.E13
  other vias: 24.6,39.87
N17_N  (via drill 0.2)
  Top 0.152: v26.82,50.93 arc-45 26.77,50.8 26.72,50.75 arc45 26.64,50.57 26.64,43.17 arc45 26.83,42.72 SENSOR.G15
  Bottom 0.152: X-NORTH.65 v26.82,50.93
  other vias: 27.14,42.41
N17_P  (via drill 0.2)
  Top 0.152: v26.32,51.31 26.32,50.71 arc-45 26.36,50.62 26.36,43.17 arc-45 26.18,42.72 SENSOR.G14
  Bottom 0.152: X-NORTH.63 v26.32,51.31
  other vias: 25.87,42.41
N18_N  (via drill 0.2)
  Bottom 0.152: X-NORTH.70 27.82,47.74 arc-45 27.64,47.29 26.83,46.48 arc45 26.64,46.03 26.64,41.9 arc45 26.83,41.45 SENSOR.F15
  other vias: 27.14,41.14
N18_P  (via drill 0.2)
  Bottom 0.152: X-NORTH.68 27.32,47.64 arc-45 27.14,47.19 26.55,46.6 arc45 26.36,46.15 26.36,41.9 arc-45 26.18,41.45 SENSOR.F14
  other vias: 25.87,41.14
N19_N  (via drill 0.2)
  Top 0.152: v28.32,50.93 arc-45 28.26,50.76 28.24,50.75 arc45 28.17,50.57 28.17,48.45 arc45 28.36,48 29,47.36 arc-45 29.18,46.91 29.18,43.17 arc45 29.37,42.72 SENSOR.G17
  Bottom 0.152: X-NORTH.71 v28.32,50.93
  other vias: 29.68,42.41
N19_P  (via drill 0.2)
  Top 0.152: v27.82,51.31 27.82,50.74 arc-45 27.89,50.58 27.89,48.34 arc45 28.07,47.89 28.72,47.25 arc-45 28.9,46.8 28.9,43.17 arc-45 28.72,42.72 SENSOR.G16
  Bottom 0.152: X-NORTH.69 v27.82,51.31
  other vias: 28.41,42.41
N20_N  (via drill 0.2)
  Bottom 0.152: X-NORTH.76 29.32,47.61 arc-45 29.26,47.45 arc45 29.18,47.27 29.18,41.9 arc45 29.37,41.45 SENSOR.F17
  other vias: 29.68,41.14
N20_P  (via drill 0.2)
  Bottom 0.152: X-NORTH.74 28.82,47.46 arc45 28.83,47.45 arc-45 28.9,47.27 28.9,41.9 arc-45 28.72,41.45 SENSOR.F16
  other vias: 28.41,41.14
N21_N  (via drill 0.2)
  Top 0.152: v29.82,50.93 29.82,50.89 arc-45 29.77,50.75 arc45 29.69,50.57 29.69,48.84 arc45 29.88,48.39 30.27,48 arc-45 30.45,47.55 30.45,44.44 arc45 30.64,43.99 SENSOR.H18
  Bottom 0.152: X-NORTH.77 29.82,50.98 v29.82,50.93
  other vias: 30.95,43.68
N21_P  (via drill 0.2)
  Top 0.152: v29.32,51.31 29.32,50.78 arc45 29.34,50.75 arc-45 29.41,50.57 29.41,48.72 arc45 29.6,48.27 29.99,47.88 arc-45 30.18,47.43 30.18,44.44 arc-45 29.99,43.99 SENSOR.H17
  Bottom 0.152: X-NORTH.75 29.32,51.36 v29.32,51.31
  other vias: 29.68,43.68
N22_N  (via drill 0.2)
  Bottom 0.152: X-NORTH.82 30.82,47.71 arc-45 30.71,47.45 30.57,47.3 arc45 30.45,47.03 30.45,40.63 arc45 30.64,40.18 SENSOR.E18
  other vias: 30.95,39.87
N22_P  (via drill 0.2)
  Bottom 0.152: X-NORTH.80 30.32,47.56 arc-45 30.25,47.38 30.25,47.38 arc45 30.18,47.2 30.18,40.63 arc-45 29.99,40.18 SENSOR.E17
  other vias: 29.68,39.87
N23_N  (via drill 0.2)
  Top 0.152: v31.32,50.93 31.32,50.83 arc-45 31.29,50.75 arc45 31.22,50.57 31.22,49.22 arc45 31.4,48.77 31.54,48.63 arc-45 31.72,48.18 31.72,43.17 arc45 31.91,42.72 SENSOR.G19
  Bottom 0.152: X-NORTH.83 31.32,50.98 v31.32,50.93
  other vias: 32.22,42.41
N23_P  (via drill 0.2)
  Top 0.152: v30.82,51.31 30.82,50.84 arc45 30.86,50.75 arc-45 30.94,50.57 30.94,49.1 arc45 31.12,48.65 31.26,48.52 arc-45 31.45,48.07 31.45,43.17 arc-45 31.26,42.72 SENSOR.G18
  Bottom 0.152: X-NORTH.81 30.82,51.36 v30.82,51.31
  other vias: 30.95,42.41
N24_N  (via drill 0.2)
  Bottom 0.152: X-NORTH.88 32.33,47.8 arc-45 32.14,47.35 31.91,47.12 arc45 31.72,46.67 31.72,41.9 arc45 31.91,41.45 SENSOR.F19
  other vias: 32.22,41.14
N24_P  (via drill 0.2)
  Bottom 0.152: X-NORTH.86 31.82,47.69 arc-45 31.64,47.24 31.63,47.23 arc45 31.45,46.78 31.45,41.9 arc-45 31.26,41.45 SENSOR.F18
  other vias: 30.95,41.14
N25_N  (via drill 0.2)
  Top 0.152: v32.83,50.93 32.83,50.77 arc-45 32.81,50.75 arc45 32.74,50.57 32.74,49.44 arc45 32.81,49.26 32.92,49.15 arc-45 32.99,48.97 32.99,44.44 arc45 33.18,43.99 SENSOR.H20
  Bottom 0.152: X-NORTH.89 32.83,50.98 v32.83,50.93
  other vias: 33.49,43.68
N25_P  (via drill 0.2)
  Top 0.152: v32.33,51.31 32.33,50.9 arc45 32.39,50.75 arc-45 32.46,50.57 32.46,49.32 arc45 32.54,49.14 32.64,49.04 arc-45 32.71,48.86 32.71,44.44 arc-45 32.53,43.99 SENSOR.H19
  Bottom 0.152: X-NORTH.87 32.33,51.36 v32.33,51.31
  other vias: 32.22,43.68
N26_N  (via drill 0.2)
  Bottom 0.152: X-NORTH.94 33.83,47.77 arc-45 33.64,47.32 33.18,46.86 arc45 32.99,46.41 32.99,40.63 arc45 33.18,40.18 SENSOR.E20
  other vias: 33.49,39.87
N26_P  (via drill 0.2)
  Bottom 0.152: X-NORTH.92 33.33,47.67 arc-45 33.14,47.22 32.9,46.98 arc45 32.71,46.53 32.71,40.63 arc-45 32.53,40.18 SENSOR.E19
  other vias: 32.22,39.87
N27_N  (via drill 0.2)
  Top 0.152: v34.33,50.93 arc-45 34.28,50.81 34.21,50.75 arc45 34.14,50.57 34.14,49.79 arc45 34.19,49.66 arc-45 34.27,49.48 34.27,43.17 arc45 34.45,42.72 SENSOR.G21
  Bottom 0.152: X-NORTH.95 34.33,50.98 v34.33,50.93
  other vias: 34.76,42.41
N27_P  (via drill 0.2)
  Top 0.152: v33.83,51.31 33.83,50.71 arc-45 33.86,50.63 33.86,49.67 arc45 33.91,49.55 arc-45 33.98,49.37 33.98,43.17 arc-45 33.8,42.72 SENSOR.G20
  Bottom 0.152: X-NORTH.93 33.83,51.36 v33.83,51.31
  other vias: 33.49,42.41
N28_N  (via drill 0.2)
  Bottom 0.152: X-NORTH.100 35.33,47.75 arc-45 35.14,47.3 34.45,46.61 arc45 34.27,46.16 34.27,41.9 arc45 34.45,41.45 SENSOR.F21
  other vias: 34.76,41.14
N28_P  (via drill 0.2)
  Bottom 0.152: X-NORTH.98 34.83,47.64 arc-45 34.64,47.19 34.17,46.73 arc45 33.98,46.28 33.98,41.9 arc-45 33.8,41.45 SENSOR.F20
  other vias: 33.49,41.14
N29_N  (via drill 0.2)
  Top 0.152: v35.83,50.93 arc-45 35.76,50.77 35.74,50.75 arc45 35.66,50.57 35.66,46.23 arc45 35.85,45.78 36.62,45.01 arc-45 36.8,44.56 36.8,43.17 arc45 36.99,42.72 SENSOR.G23
  Bottom 0.152: X-NORTH.101 35.83,50.98 v35.83,50.93
  other vias: 37.3,42.41
N29_P  (via drill 0.2)
  Top 0.152: v35.33,51.31 35.33,50.73 arc-45 35.38,50.59 35.38,46.12 arc45 35.57,45.67 36.34,44.9 arc-45 36.52,44.45 36.52,43.17 arc-45 36.34,42.72 SENSOR.G22
  Bottom 0.152: X-NORTH.99 35.33,51.36 v35.33,51.31
  other vias: 36.03,42.41
N30_N  (via drill 0.2)
  Bottom 0.152: X-NORTH.106 36.83,47.72 arc-45 36.64,47.27 35.72,46.36 arc45 35.53,45.91 35.53,40.63 arc45 35.72,40.18 SENSOR.E22
  other vias: 36.03,39.87
N30_P  (via drill 0.2)
  Bottom 0.152: X-NORTH.104 36.33,47.62 arc-45 36.14,47.17 35.44,46.47 arc45 35.25,46.02 35.25,40.63 arc-45 35.07,40.18 SENSOR.E21
  other vias: 34.76,39.87
N31_N  (via drill 0.2)
  Top 0.152: v37.33,50.93 37.33,50.9 arc-45 37.26,50.75 arc45 37.19,50.57 37.19,46.61 arc45 37.37,46.16 37.89,45.65 arc-45 38.08,45.2 38.08,44.44 arc45 38.26,43.99 SENSOR.H24
  Bottom 0.152: X-NORTH.107 37.33,50.98 v37.33,50.93
  other vias: 38.57,43.68
N31_P  (via drill 0.2)
  Top 0.152: v36.83,51.31 36.83,50.76 arc45 36.83,50.75 arc-45 36.91,50.57 36.91,46.5 arc45 37.09,46.05 37.61,45.53 arc-45 37.8,45.08 37.8,44.44 arc-45 37.61,43.99 SENSOR.H23
  Bottom 0.152: X-NORTH.105 36.83,51.36 v36.83,51.31
  other vias: 37.3,43.68
N32_N  (via drill 0.2)
  Bottom 0.152: X-NORTH.112 38.33,47.51 arc-45 38.14,47.06 36.99,45.91 arc45 36.8,45.46 36.8,41.9 arc45 36.99,41.45 SENSOR.F23
  other vias: 37.3,41.14
N32_P  (via drill 0.2)
  Bottom 0.152: X-NORTH.110 37.83,47.4 arc-45 37.64,46.95 36.71,46.03 arc45 36.52,45.58 36.52,41.9 arc-45 36.34,41.45 SENSOR.F22
  other vias: 36.03,41.14
N33_N  (via drill 0.2)
  Top 0.152: v38.83,50.93 38.83,50.85 arc-45 38.78,50.75 arc45 38.71,50.57 38.71,46.99 arc45 38.9,46.54 39.16,46.28 arc-45 39.34,45.83 39.34,43.17 arc45 39.53,42.72 SENSOR.G25
  Bottom 0.152: X-NORTH.113 38.83,50.98 v38.83,50.93
  other vias: 39.84,42.41
N33_P  (via drill 0.2)
  Top 0.152: v38.33,51.31 38.33,50.82 arc45 38.36,50.75 arc-45 38.43,50.57 38.43,46.88 arc45 38.62,46.43 38.88,46.17 arc-45 39.06,45.72 39.06,43.17 arc-45 38.88,42.72 SENSOR.G24
  Bottom 0.152: X-NORTH.111 38.33,51.36 v38.33,51.31
  other vias: 38.57,42.41
N34_N  (via drill 0.2)
  Bottom 0.152: X-NORTH.118 39.83,47.23 arc-45 39.64,46.78 38.26,45.4 arc45 38.08,44.95 38.08,40.63 arc45 38.26,40.18 SENSOR.E24
  other vias: 38.57,39.87
N34_P  (via drill 0.2)
  Bottom 0.152: X-NORTH.116 39.33,47.13 arc-45 39.14,46.68 37.98,45.52 arc45 37.8,45.07 37.8,40.63 arc-45 37.61,40.18 SENSOR.E23
  other vias: 37.3,39.87
N35_N  (via drill 0.2)
  Top 0.152: v51.69,33.59 52.77,34.68 arc45 52.96,35.12 52.96,37.08 arc45 52.77,37.52 52.64,37.66 arc-45 52.45,38.11 52.45,40 arc45 52.27,40.45 51.2,41.51 arc-45 51.02,41.96 51.02,42.7 arc45 50.83,43.15 46.16,47.82 arc45 45.71,48.01 43.66,48.01 arc-45 43.21,48.19 42.57,48.84 arc45 42.12,49.02 41.5,49.02 arc-45 41.23,49.13 40.44,49.93 arc-45 40.33,50.2 v40.33,50.9
  Bottom 0.152: X-NORTH.119 v40.33,50.9 | U6.4 51.24,33.93 arc-45 51.42,33.86 v51.69,33.59
N35_P  (via drill 0.2)
  Top 0.152: v39.83,51.31 39.83,50.19 arc45 40.01,49.74 40.92,48.83 arc45 41.37,48.64 41.99,48.64 arc-45 42.44,48.45 43.08,47.81 arc45 43.53,47.62 45.58,47.62 arc-45 46.03,47.44 50.45,43.02 arc-45 50.63,42.57 50.63,41.83 arc45 50.82,41.38 51.88,40.32 arc-45 52.07,39.87 52.07,37.85 arc45 52.26,37.41 52.39,37.27 arc-45 52.58,36.82 52.58,35.38 arc-45 52.39,34.93 v51.69,34.23
  Bottom 0.152: X-NORTH.117 v39.83,51.31 | U6.3 51.47,34.34 arc-45 51.65,34.27 v51.69,34.23
N37_N  (via drill 0.2)
  Top 0.152: v41.83,50.9 41.83,50.32 arc45 41.94,50.05 42.09,49.9 arc45 42.36,49.78 42.37,49.78 arc-45 42.82,49.6 43.46,48.95 arc45 43.91,48.77 45.97,48.77 arc-45 46.41,48.58 53.03,41.97 arc-45 53.21,41.52 53.21,39.19 arc45 53.4,38.74 v54.1,38.04
  Bottom 0.152: X-NORTH.125 v41.83,50.9 | U5.3 53.88,38.15 arc-45 54.06,38.08 v54.1,38.04
N37_P  (via drill 0.2)
  Top 0.152: v41.33,51.31 41.33,50.21 arc45 41.51,49.76 41.69,49.59 arc45 42.13,49.4 42.24,49.4 arc-45 42.69,49.22 43.34,48.57 arc45 43.79,48.39 45.84,48.39 arc-45 46.29,48.2 51.21,43.28 arc-45 51.4,42.83 51.4,42.08 arc45 51.58,41.63 52.65,40.57 arc-45 52.83,40.12 52.83,38.94 arc45 53.02,38.49 v54.1,37.4
  Bottom 0.152: X-NORTH.123 v41.33,51.31 | U5.4 53.65,37.74 arc-45 53.83,37.67 v54.1,37.4
N38_N  (via drill 0.2)
  Top 0.152: v42.83,47.24 43.99,47.24 arc-45 44.26,47.13 46.4,45 arc45 46.66,44.89 47.92,44.89 arc-45 48.19,44.77 50.07,42.9 arc-45 50.25,42.45 50.25,41.7 arc45 50.44,41.25 51.5,40.19 arc-45 51.69,39.74 51.69,37.6 arc45 51.88,37.15 52.01,37.02 arc-45 52.2,36.57 52.2,35.63 arc-45 52.01,35.18 v51.69,34.86
  Bottom 0.152: X-NORTH.130 v42.83,47.24 | U6.2 51.47,34.75 arc45 51.65,34.82 v51.69,34.86
N38_P  (via drill 0.2)
  Top 0.152: v51.69,35.5 51.69,36.44 arc45 51.5,36.89 51.49,36.9 arc-45 51.31,37.35 51.31,39.61 arc45 51.12,40.06 50.06,41.13 arc-45 49.87,41.58 49.87,42.32 arc45 49.69,42.77 48.06,44.39 arc45 47.79,44.51 46.54,44.51 arc-45 46.27,44.62 44.13,46.75 arc45 43.86,46.86 43.28,46.86 arc45 43.11,46.79 arc-45 42.98,46.74 42.78,46.74 arc-45 42.6,46.81 42.4,47 arc45 42.13,47.12 v41.69,47.12
  Bottom 0.152: X-NORTH.128 42.33,47.5 arc-90 41.94,47.12 v41.69,47.12 | U6.1 51.24,35.15 arc45 51.42,35.23 v51.69,35.5
N39_N  (via drill 0.2)
  Top 0.152: v54.1,39.31 54.1,41.65 arc45 53.92,42.1 46.67,49.34 arc45 46.22,49.53 44.06,49.53 arc-45 43.79,49.64 43.44,50 arc-45 43.33,50.27 v43.33,50.9
  Bottom 0.152: X-NORTH.131 v43.33,50.9 | U5.1 53.65,38.96 arc45 53.83,39.04 v54.1,39.31
N39_P  (via drill 0.2)
  Top 0.152: v42.83,51.31 42.83,50.36 arc45 43.01,49.91 43.59,49.34 arc45 44.04,49.15 46.09,49.15 arc-45 46.54,48.96 53.41,42.1 arc-45 53.59,41.65 53.59,39.44 arc45 53.78,38.99 v54.1,38.67
  Bottom 0.152: X-NORTH.129 v42.83,51.31 | U5.2 53.88,38.56 arc45 54.06,38.63 v54.1,38.67
N$1
  Bottom 0.152: UEP.7 50.67,47.5 arc-90 50.42,47.75 50.42,48.06 arc-45 50.61,48.51 51.59,49.49 arc-45 52.03,49.68 R1X.2 52.28,49.66 R2X.1
N$5  (via drill 0.2)
  Bottom 0.254: C60.1 11.14,44.52 arc45 11.19,44.39 arc-45 11.27,44.21 11.27,43.31 arc-45 11.08,42.86 SENSOR.G2
  other vias: 10.63,42.41
N$6  (via drill 0.2)
  Bottom 0.254: C61.1 8.72,40.24 arc-45 8.91,40.69 SENSOR.F1
  other vias: 9.36,41.14
N$11  (via drill 0.2)
  Bottom 0.254: C62.1 10.12,18.85 arc-45 10.09,18.76 10.03,18.71 arc45 10,18.62 10,17.64 SENSOR.C1
  other vias: 9.36,17.01
N$12  (via drill 0.2)
  Bottom 0.254: C63.1 12.92,19.15 arc45 12.99,18.97 13.1,18.86 arc-45 13.17,18.68 SENSOR.D4
  other vias: 13.17,18.28
N$15  (via drill 0.2)
  Bottom 0.254: SENSOR.C29 44.47,17.46 arc-45 44.28,17.91 44.28,18.61 arc-45 44.32,18.7 44.38,18.75 arc45 44.41,18.84 C64.1
  other vias: 44.92,17.01
N$16  (via drill 0.2)
  Bottom 0.254: C71.1 12.15,19.2 arc45 12.27,18.93 12.42,18.77 arc-45 12.54,18.5 12.54,17.91 arc45 12.72,17.46 SENSOR.C4
  other vias: 13.17,17.01
N$17  (via drill 0.2)
  Bottom 0.254: C14.1 13.3,14.16 arc45 SENSOR.A4
  other vias: 13.17,14.47
N$18  (via drill 0.2)
  Bottom 0.254: C15.1 SENSOR.D5
  other vias: 14.44,18.28
N$19
  Bottom 0.152: U3.5 5.21,17.13 R21.1 6.25,17.14 arc-45 6.42,17.07 6.66,16.84 arc-45 6.73,16.66 6.73,16.61 arc45 6.8,16.44 6.89,16.35 arc45 7.07,16.27 R22.2
N$21  (via drill 0.2)
  Bottom 0.254: SENSOR.C5 13.99,17.46 arc-45 13.8,17.91 13.8,18.61 arc45 13.77,18.7 13.71,18.75 arc-45 13.68,18.84 C18.1
  other vias: 14.44,17.01
N$22  (via drill 0.2)
  Bottom 0.254: C19.1 15.96,18.65 arc-45 15.89,18.47 15.78,18.36 arc45 15.71,18.18 SENSOR.D6
  other vias: 15.71,18.28
N$23  (via drill 0.2)
  Bottom 0.254: SENSOR.B30 45.74,15.29 arc45 45.55,14.84 45.55,14.14 arc-45 45.52,14.05 45.47,14 arc45 45.43,13.91 C20.1
  other vias: 46.19,15.74
N$24  (via drill 0.2)
  Bottom 0.254: SENSOR.C30 45.74,17.46 arc-45 45.55,17.91 45.55,18.61 arc45 45.52,18.7 45.47,18.75 arc-45 45.43,18.84 C21.1
  other vias: 46.19,17.01
N$25  (via drill 0.2)
  Bottom 0.254: C22.2 10.25,39.13 arc45 10.18,39.31 10.07,39.41 arc-45 10,39.59 10,40.24 arc-45 10.18,40.69 SENSOR.F2
  other vias: 10.63,41.14
N$26  (via drill 0.2)
  Bottom 0.254: C23.2 10,14.84 arc45 9.81,15.29 SENSOR.B1
  other vias: 9.36,15.74
N$27  (via drill 0.2)
  Bottom 0.254: C24.2 44.28,14.84 arc-45 44.47,15.29 SENSOR.B29
  other vias: 44.92,15.74
N$28  (via drill 0.2)
  Bottom 0.254: SENSOR.C6 15.26,17.46 arc-45 15.07,17.91 15.07,18.61 arc-45 15.11,18.7 15.16,18.75 arc45 15.2,18.84 C25.2
  other vias: 15.71,17.01
N$29  (via drill 0.2)
  Bottom 0.254: C26.2 SENSOR.D1
  other vias: 9.36,18.28
N$30  (via drill 0.2)
  Bottom 0.254: C27.2 11.77,38.97 arc45 11.59,39.42 11.45,39.56 arc-45 11.27,40.01 11.27,40.24 arc-45 11.45,40.69 SENSOR.F3
  other vias: 11.9,41.14
N$31  (via drill 0.2)
  Bottom 0.254: C28.2 SENSOR.H3
  other vias: 11.9,43.68
N$32  (via drill 0.2)
  Bottom 0.254: C29.1 11.77,14.16 arc-45 SENSOR.A3
  other vias: 11.9,14.47
N$33  (via drill 0.2)
  Bottom 0.254: SENSOR.B3 11.45,15.29 arc45 11.27,14.84 11.27,14.25 arc-45 11.15,13.98 11.12,13.95 arc45 11.01,13.68 C30.1
  other vias: 11.9,15.74
N$36  (via drill 0.2)
  other vias: 10.63,43.68
N$37  (via drill 0.2)
  other vias: 38.57,41.14
N$38  (via drill 0.2)
  other vias: 13.17,41.14
N$39  (via drill 0.2)
  other vias: 13.17,39.87
N$40  (via drill 0.2)
  other vias: 13.17,43.68
N$41  (via drill 0.2)
  other vias: 11.9,42.41
N$42  (via drill 0.2)
  other vias: 10.63,14.47
N$43  (via drill 0.2)
  other vias: 39.84,41.14
N$44  (via drill 0.2)
  other vias: 11.9,17.01
N$45  (via drill 0.2)
  other vias: 9.36,14.47
N$46  (via drill 0.2)
  other vias: 37.3,15.74
N$47  (via drill 0.2)
  other vias: 37.3,17.01
N$48
  Bottom 0.152: U6.9 48.84,33.93 arc45 48.66,33.86 48.59,33.79 arc-45 48.41,33.72 48.2,33.72 arc-90 47.94,33.97 47.94,35.77 arc45 47.87,35.95 TP9.TP
N$172  (via drill 0.2)
  Top 0.152: v49.89,15.11 50.28,15.11 arc45 50.73,15.3 50.87,15.43 arc-45 51.32,15.62 52.19,15.62 arc-45 52.64,15.43 v52.96,15.11
  Bottom 0.152: USE.6 53.09,14.8 arc45 v52.96,15.11
  Bottom 0.203: R11.2 R12.1 v49.89,15.11
N$173  (via drill 0.2)
  Top 0.152: v4.19,37.59 4.51,37.27 arc45 4.96,37.08 5.83,37.08 arc45 6.28,37.27 6.42,37.41 arc-45 6.87,37.59 v7.26,37.59
  Bottom 0.152: UNN.6 4.06,37.91 arc45 v4.19,37.59
  Bottom 0.203: R5.2 R6.1 v7.26,37.59
N$182  (via drill 0.2)
  Route15 0.152: v4.19,33.15 4.51,33.47 arc-45 4.96,33.66 5.83,33.66 arc-45 6.28,33.47 6.42,33.33 arc45 6.87,33.15 v7.26,33.15
  Bottom 0.152: UNE.6 4.06,33.46 arc45 v4.19,33.15
  Bottom 0.203: R8.2 R9.1 v7.26,33.15
N$183
  Bottom 0.152: USE.3 53.09,11.81 arc-90 52.84,11.56 51.56,11.56 arc-90 51.18,11.94 51.18,12.7 arc90 50.93,12.95 R10.2
  Bottom 0.203: R10.2 R11.1
N$188
  Bottom 0.152: UNE.3 4.06,36.45 arc-90 4.31,36.7 5.59,36.7 arc-90 5.97,36.32 5.97,35.56 arc90 6.22,35.31 R7.2
  Bottom 0.203: R8.1 R7.2
N$191
  Bottom 0.152: R1.2 6.22,44.2 arc-90 5.97,44.45 5.97,45.21 arc90 5.59,45.59 4.31,45.59 arc90 4.06,45.34 UNW.3
  Bottom 0.203: R1.2 R2.1
N$192  (via drill 0.2)
  Top 0.152: v7.26,42.04 6.87,42.04 arc45 6.42,41.85 6.28,41.72 arc-45 5.83,41.53 4.96,41.53 arc-45 4.51,41.72 v4.19,42.04
  Bottom 0.152: UNW.6 4.06,42.35 arc45 v4.19,42.04
  Bottom 0.203: R2.2 R3.1 v7.26,42.04
N$193  (via drill 0.2)
  Top 0.152: v52.96,19.56 52.64,19.88 arc45 52.19,20.07 51.32,20.07 arc45 50.87,19.88 50.73,19.74 arc-45 50.28,19.56 v49.89,19.56
  Bottom 0.152: USS.6 53.09,19.24 arc45 v52.96,19.56
  Bottom 0.203: R14.2 R15.1 v49.89,19.56
N$194
  Bottom 0.152: USS.3 53.09,16.26 arc-90 52.84,16 51.56,16 arc-90 51.18,16.38 51.18,17.14 arc90 50.93,17.4 R13.2
  Bottom 0.203: R14.1 R13.2
N$195
  Bottom 0.152: USW.3 53.09,20.7 arc-90 52.84,20.45 51.56,20.45 arc-90 51.18,20.83 51.18,21.59 arc90 50.93,21.84 R16.2
  Bottom 0.203: R17.1 R16.2
N$196  (via drill 0.2)
  Route15 0.152: v52.96,24 52.64,23.68 arc-45 52.19,23.49 51.32,23.49 arc-45 50.87,23.68 50.73,23.82 arc45 50.28,24 v49.89,24
  Bottom 0.152: USW.6 53.09,23.69 arc45 v52.96,24 | R17.2 R18.1 v49.89,24
N_CHK_V  (via drill 0.2)
  Top 0.152: v5.46,43.18 3.59,43.18 arc45 3.14,42.99 3.11,42.96 arc45 2.92,42.52 v2.92,42.04 | v5.46,34.29 3.59,34.29 arc45 3.14,34.1 3.11,34.07 arc45 2.92,33.62 v2.92,33.15 | v5.46,38.73 3.59,38.73 arc45 3.14,38.55 3.11,38.52 arc45 2.92,38.07 v2.92,37.59
  Route2 0.305: v12.83,47.24 12.38,47.69 arc45 11.93,47.88 v7.11,47.88 6.54,47.3 arc45 6.35,46.85 6.35,44.07 | 6.35,44.07 6.35,39.62 | 6.35,39.62 6.35,35.44 arc-45 6.16,34.99 v5.46,34.29 | v5.46,38.73 6.35,39.62 | v5.46,43.18 6.35,44.07
  Bottom 0.152: R19.1 TP1.TP
  Bottom 0.203: UNW.8 3.06,42.37 arc-45 v2.92,42.04 | UNE.8 3.06,33.48 arc-45 v2.92,33.15 | UNN.8 3.06,37.93 arc-45 v2.92,37.59 | C2.1 v5.46,43.18 | C3.1 v5.46,38.73 | C4.1 v5.46,34.29 | X-NORTH.10 12.82,47.6 12.83,47.6 v12.83,47.24
  Bottom 0.254: v7.11,47.88 TP1.TP
N_I2C_V  (via drill 0.2)
  Route2 0.254: 44.33,51.81 v44.33,51.82
  Route2 0.406: v44.33,51.82 44.33,51.69 arc45 44.51,51.25 46.94,48.82 arc45 47.39,48.64 v51.37,48.64
  Bottom 0.152: 52.27,48.89 R1X.1
  Bottom 0.254: C1.1 52.27,48.89 | R1X.1 51.72,48.88 arc45 51.54,48.8 v51.37,48.64 UEP.8 | X-NORTH.135 44.33,52.32 v44.33,51.82
N_REF  (via drill 0.2)
  Top 0.152: v4.83,37.59 4.97,37.73 arc-45 5.24,37.85 5.45,37.85 arc45 5.9,38.03 6.04,38.17 arc45 6.22,38.62 6.22,38.85 arc45 6.04,39.3 5.9,39.44 arc45 5.45,39.62 4.45,39.62 arc-45 4,39.81 3.74,40.07 arc-45 3.56,40.52 v3.56,41.15 | v4.83,33.15 4.97,33.29 arc-45 5.24,33.4 5.45,33.4 arc45 5.9,33.59 6.04,33.72 arc45 6.22,34.17 6.22,34.41 arc45 6.04,34.86 5.9,34.99 arc45 5.45,35.18 4.45,35.18 arc-45 4,35.37 3.74,35.63 arc-45 3.56,36.08 v3.56,36.7 | v4.83,42.04 4.97,42.18 arc-45 5.24,42.29 5.45,42.29 arc45 5.9,42.48 6.04,42.61 arc45 6.22,43.06 6.22,43.3 arc45 6.04,43.75 5.9,43.88 arc45 5.45,44.07 4.45,44.07 arc-45 4,44.25 3.74,44.52 arc-45 3.56,44.97 v3.56,45.59
  Route15 0.152: v3.56,41.15 3.67,41.15 arc45 4.12,41.33 v4.83,42.04 | v3.56,36.7 3.67,36.7 arc45 4.12,36.89 v4.83,37.59
  Bottom 0.152: UNN.2 v3.56,41.14 v3.56,41.15 | UNN.5 4.56,38.12 arc45 4.75,37.67 v4.83,37.59 | UNE.2 v3.56,36.7 | UNE.5 4.56,33.68 arc45 4.75,33.23 v4.83,33.15 | UNW.5 4.56,42.57 arc45 4.75,42.12 v4.83,42.04 | UNW.2 v3.56,45.59 | v3.56,45.59 | TP2.TP 5.46,46.99 | 5.46,46.99 R19.2 | v3.56,45.59 | v3.56,45.59 arc-90 3.94,45.97 4.09,45.97 arc90 4.47,46.36 U1.1 | U1.1 4.47,46.99 5.46,46.99 | U1.1 4.47,47.56 arc90 4.22,47.82 3.4,47.82 arc90 3.15,47.56 U1.3
N_SCK
  Bottom 0.152: X-NORTH.144 46.33,47.62 arc90 46.71,47.24 47.49,47.24 arc-45 47.94,47.06 49.93,45.07 arc45 50.2,44.96 50.9,44.96 arc-45 51.17,44.85 51.83,44.18 arc-45 51.94,43.91 51.94,42.91 arc-45 51.83,42.64 51.67,42.48 arc-45 51.4,42.37 U4.2
N_SCL  (via drill 0.2)
  Route2 0.152: v50.16,46.99 50.79,46.99 arc45 51.24,47.18 52.01,47.95 arc45 52.2,48.4 52.2,49.09 arc90 51.82,49.47 47.57,49.47 arc-45 47.12,49.65 46.51,50.26 arc-45 46.33,50.71 v46.33,51.31
  Bottom 0.152: v46.33,51.31 X-NORTH.143 | UEP.6 v50.16,46.99